# Altium project Smart Camera.PrjPcb (part 1 of 2)
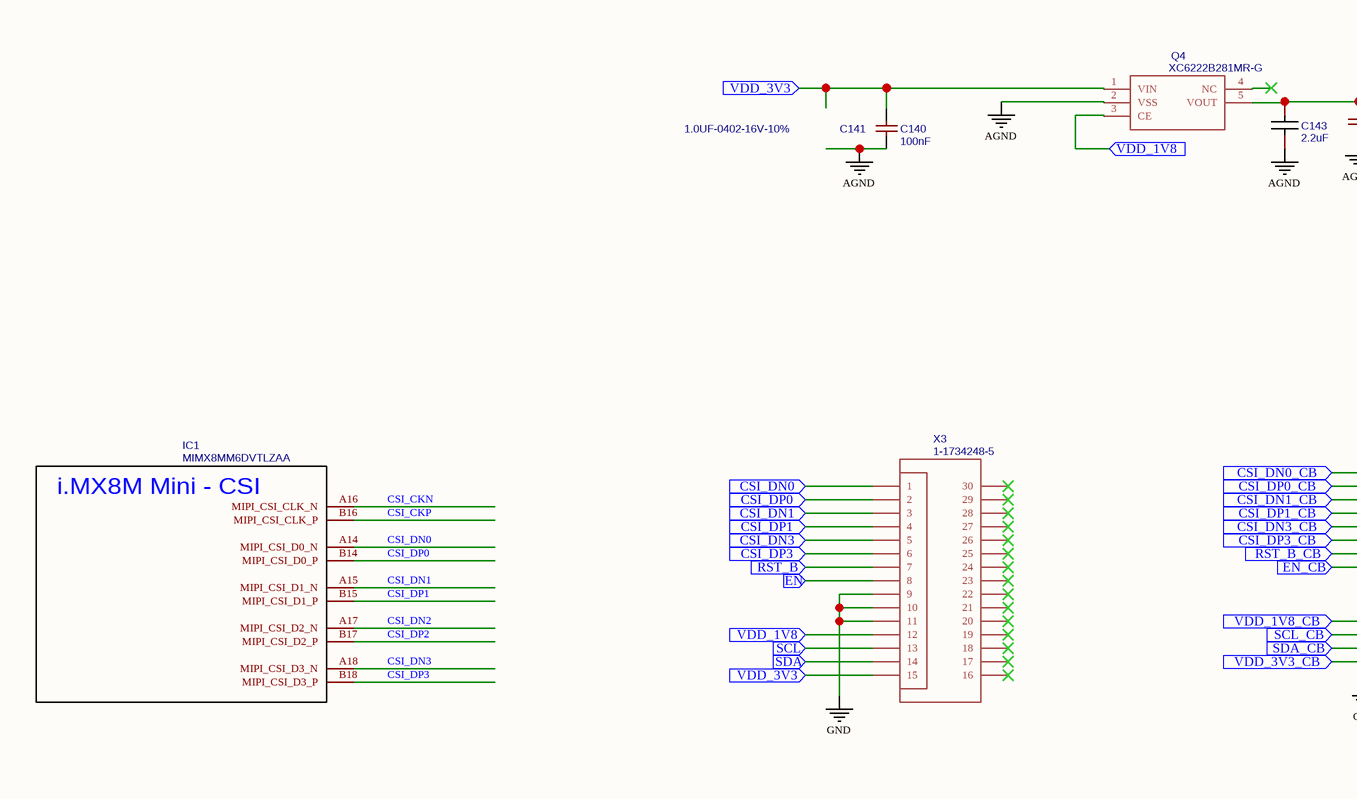
[diagram p0: CAMERA.schdoc, left]
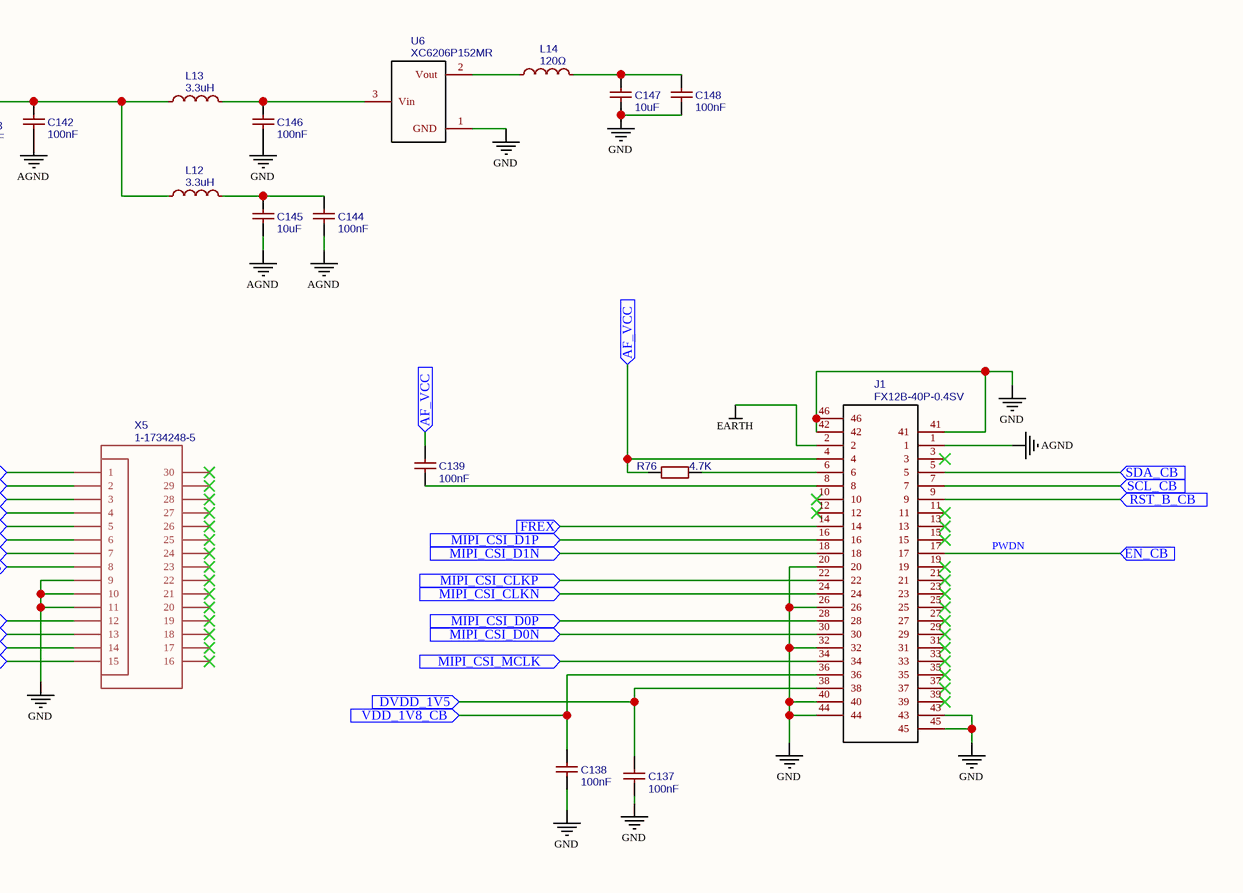
[diagram p1: CAMERA.schdoc, right]
12 sheets, 363 parts. Net scope: flat (ports and power ports of the same name join across sheets).
Sheets:
  CAMERA.schdoc
  CPU MISC.schdoc
  DDR4.schdoc
  JTAG.schdoc
  NAND.schdoc
  NOT CONNECTED.schdoc
  PMIC.schdoc
  PoE FLYBACK.schdoc
  PoE.schdoc
  POWER.schdoc
  SYS_POWER.schdoc
  BT.schdoc

## Sheet CAMERA.schdoc
size 489 x 171 mm

### Parts
(Parts that share a designator on the sheet are numbered #1, #2 ... from top to bottom, then left to right.)
C137  100nF  [C0402]
C138  100nF  [C0402]
C139  100nF  [C0402]
C140  100nF  [C0402]
C141  1.0UF-0402-16V-10%  [0402]
C142  100nF  [C0402]
C143  2.2uF  [C0402]
C144  100nF  [C0402]
C145  10uF  [C0805]
C146  100nF  [C0402]
C147  10uF  [C0805]
C148  100nF  [C0402]
IC1#1  MIMX8MM6DVTLZAA  [BGA486C50P27X27_1400X1400X125]
J1  FX12B-40P-0.4SV  [FX12B40P04SV]
L12  3.3uH  [L0402]
L13  3.3uH  [L0402]
L14  120Ω  [L0402]
Q4  XC6222B281MR-G  [SOT95P280X130-5N]
R76  4.7K  [R0402]
U6  XC6206P152MR  [SOT-23-3_L2.9-W1.6-P1.90-LS2.8-BR]
X3  1-1734248-5  [1-1734248-5]
X5  1-1734248-5  [1-1734248-5]

### Ports
AF_VCC (in), CSI_DN0 (in), CSI_DN0_CB (in), CSI_DN1 (in), CSI_DN1_CB (in), CSI_DN3 (in), CSI_DN3_CB (in), CSI_DP0 (in), CSI_DP0_CB (in), CSI_DP1 (in), CSI_DP1_CB (in), CSI_DP3 (in), CSI_DP3_CB (in), DVDD_1V5 (in), EN (in), EN_CB (in), FREX (in), MIPI_CSI_CLKN (in), MIPI_CSI_CLKP (in), MIPI_CSI_D0N (in), MIPI_CSI_D0P (in), MIPI_CSI_D1N (in), MIPI_CSI_D1P (in), MIPI_CSI_MCLK (in), RST_B (in), RST_B_CB (in), SCL (in), SCL_CB (in), SDA (in), SDA_CB (in), VDD_1V8 (in), VDD_1V8_CB (in), VDD_3V3 (in), VDD_3V3_CB (in)

### Nets
AGND: C140.1 C142.1 C143.1 C144.1 C145.1 J1.1 Q4.2(VSS)
EARTH: J1.2
GND: C137.1 C138.1 C146.1 C147.1 C148.1 J1.20 J1.26 J1.32 J1.40 J1.41 J1.42 J1.43 J1.44 J1.45 J1.46 U6.1(GND) X3.9 X3.10 X3.11 X5.9 X5.10 X5.11
CSI_CKN: IC1#1.A16(MIPI_CSI_CLK_N)
CSI_CKP: IC1#1.B16(MIPI_CSI_CLK_P)
CSI_DN0: IC1#1.A14(MIPI_CSI_D0_N)
CSI_DN1: IC1#1.A15(MIPI_CSI_D1_N)
CSI_DN2: IC1#1.A17(MIPI_CSI_D2_N)
CSI_DN3: IC1#1.A18(MIPI_CSI_D3_N)
CSI_DP0: IC1#1.B14(MIPI_CSI_D0_P)
CSI_DP1: IC1#1.B15(MIPI_CSI_D1_P)
CSI_DP2: IC1#1.B17(MIPI_CSI_D2_P)
CSI_DP3: IC1#1.B18(MIPI_CSI_D3_P)
PWDN: J1.17 X5.8 ; port EN_CB
NetC33_2: Q4.3(CE) X3.12 ; port VDD_1V8
NetC37_2: C140.2 Q4.1(VIN) X3.15 ; port VDD_3V3
NetC137_2: C137.2 J1.38 ; port DVDD_1V5
NetC138_2: C138.2 J1.36 X5.12 ; port VDD_1V8_CB
NetC139_1: C139.1 J1.8
NetC139_2: C139.2 J1.4 R76.1 ; port AF_VCC
NetC142_2: C142.2 C143.2 L12.1 L13.1 Q4.5(VOUT)
NetC144_2: C144.2 C145.2 L12.2
NetC146_2: C146.2 L13.2 U6.3(Vin)
NetC147_2: C147.2 C148.2 L14.2
NetJ1_5: J1.5 X5.14 ; port SDA_CB
NetJ1_6: J1.6 R76.2
NetJ1_7: J1.7 X5.13 ; port SCL_CB
NetJ1_9: J1.9 X5.7 ; port RST_B_CB
NetJ1_14: J1.14 ; port FREX
NetJ1_16: J1.16 ; port MIPI_CSI_D1P
NetJ1_18: J1.18 ; port MIPI_CSI_D1N
NetJ1_22: J1.22 ; port MIPI_CSI_CLKP
NetJ1_24: J1.24 ; port MIPI_CSI_CLKN
NetJ1_28: J1.28 ; port MIPI_CSI_D0P
NetJ1_30: J1.30 ; port MIPI_CSI_D0N
NetJ1_34: J1.34 ; port MIPI_CSI_MCLK
NetL14_1: L14.1 U6.2(Vout)
NetX3_1: X3.1 ; port CSI_DN0
NetX3_2: X3.2 ; port CSI_DP0
NetX3_3: X3.3 ; port CSI_DN1
NetX3_4: X3.4 ; port CSI_DP1
NetX3_5: X3.5 ; port CSI_DN3
NetX3_6: X3.6 ; port CSI_DP3
NetX3_7: X3.7 ; port RST_B
NetX3_8: X3.8 ; port EN
NetX3_13: X3.13 ; port SCL
NetX3_14: X3.14 ; port SDA
NetX5_1: X5.1 ; port CSI_DN0_CB
NetX5_2: X5.2 ; port CSI_DP0_CB
NetX5_3: X5.3 ; port CSI_DN1_CB
NetX5_4: X5.4 ; port CSI_DP1_CB
NetX5_5: X5.5 ; port CSI_DN3_CB
NetX5_6: X5.6 ; port CSI_DP3_CB
NetX5_15: X5.15 ; port VDD_3V3_CB

Not connected (* = marked no-connect by the designer): J1 3* 10* 11* 12* 13* 15* 19* 21* 23* 25* 27* 29* 31* 33* 35* 37* 39*; Q4 4(NC)*; X3 16* 17* 18* 19* 20* 21* 22* 23* 24* 25* 26* 27* 28* 29* 30*; X5 16* 17* 18* 19* 20* 21* 22* 23* 24* 25* 26* 27* 28* 29* 30*

### Notes on the sheet
- (in symbol MIMX8MM6DVTLZAA) i.MX8M Mini - CSI

### Library data of the parts
C137-C140 C142 C144 C146 C148 = 100nF: BOM_Manufacturer Part: CL05B104KO5NNNC; BOM_Manufacturer: SAMSUNG; nameAlias: Capacitance; SMT Type: Basic; BOM_Supplier: LCSC; BOM_Supplier Part: C1525; BOM_JLCPCB SMD: Yes; spicePre: C; spiceSymbolName: CL05B104KO5NNNC
C141 = 1.0UF-0402-16V-10%: Contributor: Victor De la Torre; spicePre: C; spiceSymbolName: 1.0UF-0402-16V-10%
C143 = 2.2uF: BOM_Manufacturer Part: CL05A225MQ5NSNC; BOM_Manufacturer: SAMSUNG; nameAlias: Capacitance; SMT Type: Extend; BOM_Supplier: LCSC; BOM_Supplier Part: C12530; BOM_JLCPCB SMD: Yes; spicePre: C; spiceSymbolName: CL05A225MQ5NSNC
C145 C147 = 10uF: BOM_Manufacturer Part: CL21A106KAYNNNE; BOM_Manufacturer: SAMSUNG; nameAlias: Capacitance; SMT Type: Basic; BOM_Supplier: LCSC; BOM_Supplier Part: C15850; BOM_JLCPCB SMD: Yes; spicePre: C; spiceSymbolName: CL21A106KAYNNNE
IC1#1 = MIMX8MM6DVTLZAA: subpart_no: 2; Contributor: Ke'Ondrae_Mell; spicePre: I; spiceSymbolName: MIMX8MM6DVTLZAA
J1 = FX12B-40P-0.4SV: Contributor: Ke'Ondrae_Mell; spicePre: J; spiceSymbolName: FX12B-40P-0.4SV
L12 L13 = 3.3uH: BOM_Manufacturer Part: SDFL1005Q3R3KTF; BOM_Manufacturer: Sunlord; nameAlias: Inductance; SMT Type: Extend; BOM_Supplier: LCSC; BOM_Supplier Part: C84474; BOM_JLCPCB SMD: Yes; spicePre: L; spiceSymbolName: SDFL1005Q3R3KTF
L14 = 120Ω: BOM_Manufacturer: MuRata; BOM_Manufacturer Part: BLM15AG121SN1D; nameAlias: Value; SMT Type: Extend; BOM_Supplier: LCSC; BOM_Supplier Part: C85812; BOM_JLCPCB SMD: Yes; spicePre: L; spiceSymbolName: BLM15AG121SN1D
Q4 = XC6222B281MR-G: Contributor: Ke'Ondrae_Mell; spicePre: Q; spiceSymbolName: XC6222B281MR-G
R76 = 4.7K: BOM_Manufacturer: UniOhm; BOM_Manufacturer Part: 0402WGF4701TCE; nameAlias: Resistance (Ohms); SMT Type: Basic; BOM_Supplier: LCSC; BOM_Supplier Part: C25900; BOM_JLCPCB SMD: Yes; spicePre: R; spiceSymbolName: 0402WGF4701TCE
U6 = XC6206P152MR: BOM_Manufacturer: TOREX; SMT Type: Extend; BOM_Supplier: LCSC; BOM_Manufacturer Part: XC6206P152MR; image: //image.lceda.cn/szlcsc/C56110.jpg; BOM_Supplier Part: C56110; BOM_JLCPCB SMD: Yes; spicePre: U; spiceSymbolName: XC6206P152MR
X3 X5 = 1-1734248-5: Contributor: IBE_Acc; spicePre: X; spiceSymbolName: 1-1734248-5

## Sheet CPU MISC.schdoc
size 451 x 234 mm
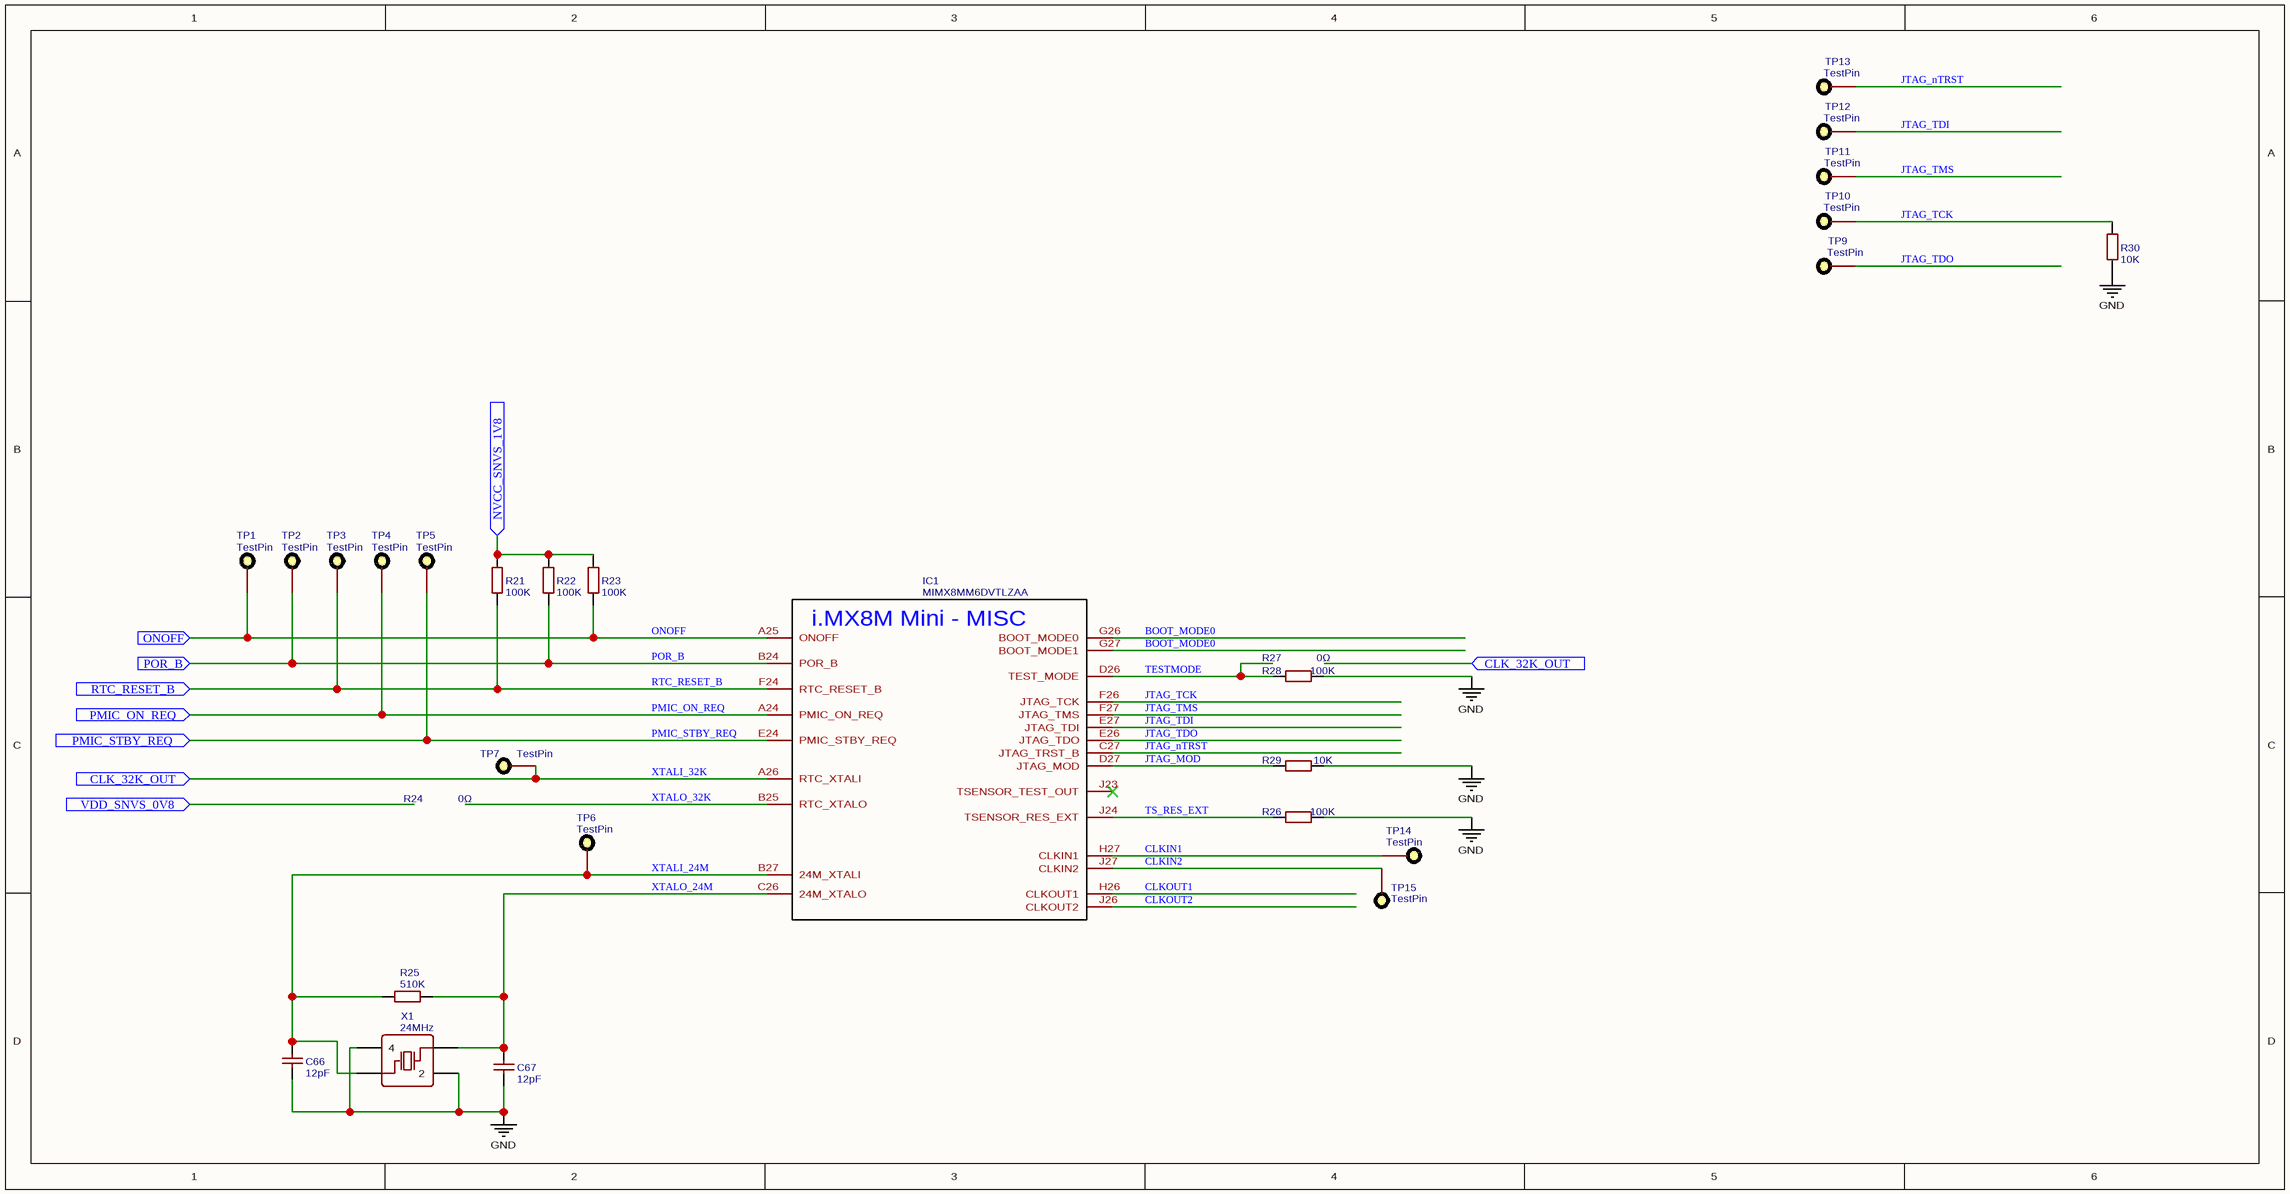
[diagram p2: CPU MISC.schdoc]

### Parts
(Parts that share a designator on the sheet are numbered #1, #2 ... from top to bottom, then left to right.)
C66  12pF  [C0402]
C67  12pF  [C0402]
IC1#2  MIMX8MM6DVTLZAA  [BGA486C50P27X27_1400X1400X125]
R21  100K  [R0402]
R22  100K  [R0402]
R23  100K  [R0402]
R24  0Ω  [1206]
R25  510K  [R0402]
R26  100K  [R0402]
R27  0Ω  [1206]
R28  100K  [R0402]
R29  10K  [R0402]
R30  10K  [R0402]
TP1  TestPin  [TESTPIN]
TP2  TestPin  [TESTPIN]
TP3  TestPin  [TESTPIN]
TP4  TestPin  [TESTPIN]
TP5  TestPin  [TESTPIN]
TP6  TestPin  [TESTPIN]
TP7  TestPin  [TESTPIN]
TP9  TestPin  [TESTPIN]
TP10  TestPin  [TESTPIN]
TP11  TestPin  [TESTPIN]
TP12  TestPin  [TESTPIN]
TP13  TestPin  [TESTPIN]
TP14  TestPin  [TESTPIN]
TP15  TestPin  [TESTPIN]
X1  24MHz  [OSC-SMD_4P-L3.2-W2.5-BL]

### Ports
CLK_32K_OUT (in), NVCC_SNVS_1V8 (in), ONOFF (in), PMIC_ON_REQ (in), PMIC_STBY_REQ (in), POR_B (in), RTC_RESET_B (in), VDD_SNVS_0V8 (in)

### Nets
GND: C66.1 C67.1 R26.1 R28.1 R29.2 R30.1 X1.2 X1.4
BOOT_MODE0: IC1#2.G26(BOOT_MODE0) IC1#2.G27(BOOT_MODE1)
CLKIN1: IC1#2.H27(CLKIN1) TP14.1
CLKIN2: IC1#2.J27(CLKIN2) TP15.1
CLKOUT1: IC1#2.H26(CLKOUT1)
CLKOUT2: IC1#2.J26(CLKOUT2)
JTAG_MOD: IC1#2.D27(JTAG_MOD) R29.1
JTAG_nTRST: IC1#2.C27(JTAG_TRST_B) TP13.1
JTAG_TCK: IC1#2.F26(JTAG_TCK) R30.2 TP10.1
JTAG_TDI: IC1#2.E27(JTAG_TDI) TP12.1
JTAG_TDO: IC1#2.E26(JTAG_TDO) TP9.1
JTAG_TMS: IC1#2.F27(JTAG_TMS) TP11.1
ONOFF: IC1#2.A25(ONOFF) R23.1 TP1.1 ; port ONOFF
PMIC_ON_REQ: IC1#2.A24(PMIC_ON_REQ) TP4.1 ; port PMIC_ON_REQ
PMIC_STBY_REQ: IC1#2.E24(PMIC_STBY_REQ) TP5.1 ; port PMIC_STBY_REQ
POR_B: IC1#2.B24(POR_B) R22.1 TP2.1 ; port POR_B
RTC_RESET_B: IC1#2.F24(RTC_RESET_B) R21.1 TP3.1 ; port RTC_RESET_B
TESTMODE: IC1#2.D26(TEST_MODE) R28.2
TS_RES_EXT: IC1#2.J24(TSENSOR_RES_EXT) R26.2
XTALI_24M: C66.2 IC1#2.B27(24M_XTALI) R25.1 TP6.1 X1.1(OSC1)
XTALI_32K: IC1#2.A26(RTC_XTALI) TP7.1 ; port CLK_32K_OUT
XTALO_24M: C67.2 IC1#2.C26(24M_XTALO) R25.2 X1.3(OSC2)
XTALO_32K: IC1#2.B25(RTC_XTALO)
NetC1_2: R21.2 R22.2 R23.2 ; port NVCC_SNVS_1V8

Not connected (* = marked no-connect by the designer): IC1#2 J23(TSENSOR_TEST_OUT)*

### Notes on the sheet
- (in symbol MIMX8MM6DVTLZAA) i.MX8M Mini - MISC

### Library data of the parts
C66 C67 = 12pF: BOM_Manufacturer: FH; BOM_Manufacturer Part: 0402CG120J500NT; nameAlias: Capacitance; SMT Type: Basic; BOM_Supplier: LCSC; BOM_Supplier Part: C1547; BOM_JLCPCB SMD: Yes; spicePre: C; spiceSymbolName: 0402CG120J500NT
IC1#2 = MIMX8MM6DVTLZAA: as IC1#1 on sheet CAMERA; spicePre: I; spiceSymbolName: MIMX8MM6DVTLZAA
R21-R23 R26 R28 = 100K: BOM_Manufacturer: UniOhm; BOM_Manufacturer Part: 0402WGF1003TCE; nameAlias: Resistance (Ohms); SMT Type: Basic; BOM_Supplier: LCSC; BOM_Supplier Part: C25741; BOM_JLCPCB SMD: Yes; spicePre: R; spiceSymbolName: 0402WGF1003TCE
R24 R27 = 0Ω: BOM_Manufacturer Part: 0R(000) ±1%; Value: 0Ω; BOM_Supplier Part: undefined; BOM_Supplier: LCSC; spicePre: R; spiceSymbolName: 0Ω
R25 = 510K: BOM_Manufacturer: UniOhm; BOM_Manufacturer Part: 0402WGF5103TCE; nameAlias: Resistance (Ohms); SMT Type: Basic; BOM_Supplier: LCSC; BOM_Supplier Part: C11616; BOM_JLCPCB SMD: Yes; spicePre: R; spiceSymbolName: 0402WGF5103TCE
R29 R30 = 10K: BOM_Manufacturer: UniOhm; BOM_Manufacturer Part: TC0225F1002TCE; nameAlias: Resistance (Ohms); SMT Type: Extend; BOM_Supplier: LCSC; BOM_Supplier Part: C98838; BOM_JLCPCB SMD: Yes; spicePre: R; spiceSymbolName: TC0225F1002TCE
TP1-TP7 TP9-TP15 = TestPin: Contributor: alan.green; sourceId: WTb5nFXR9; timeStamp: 1460711565; spicePre: T; spiceSymbolName: TestPin
X1 = 24MHz: BOM_Manufacturer: KDS; BOM_Manufacturer Part: DSX321G 24MHz; nameAlias: Frequency; Contributor: LCSC; SMT Type: Extend; BOM_Supplier: LCSC; BOM_Supplier Part: C93235; BOM_JLCPCB SMD: Yes; spicePre: X; spiceSymbolName: DSX321G 24MHz

## Sheet DDR4.schdoc
size 492 x 319 mm
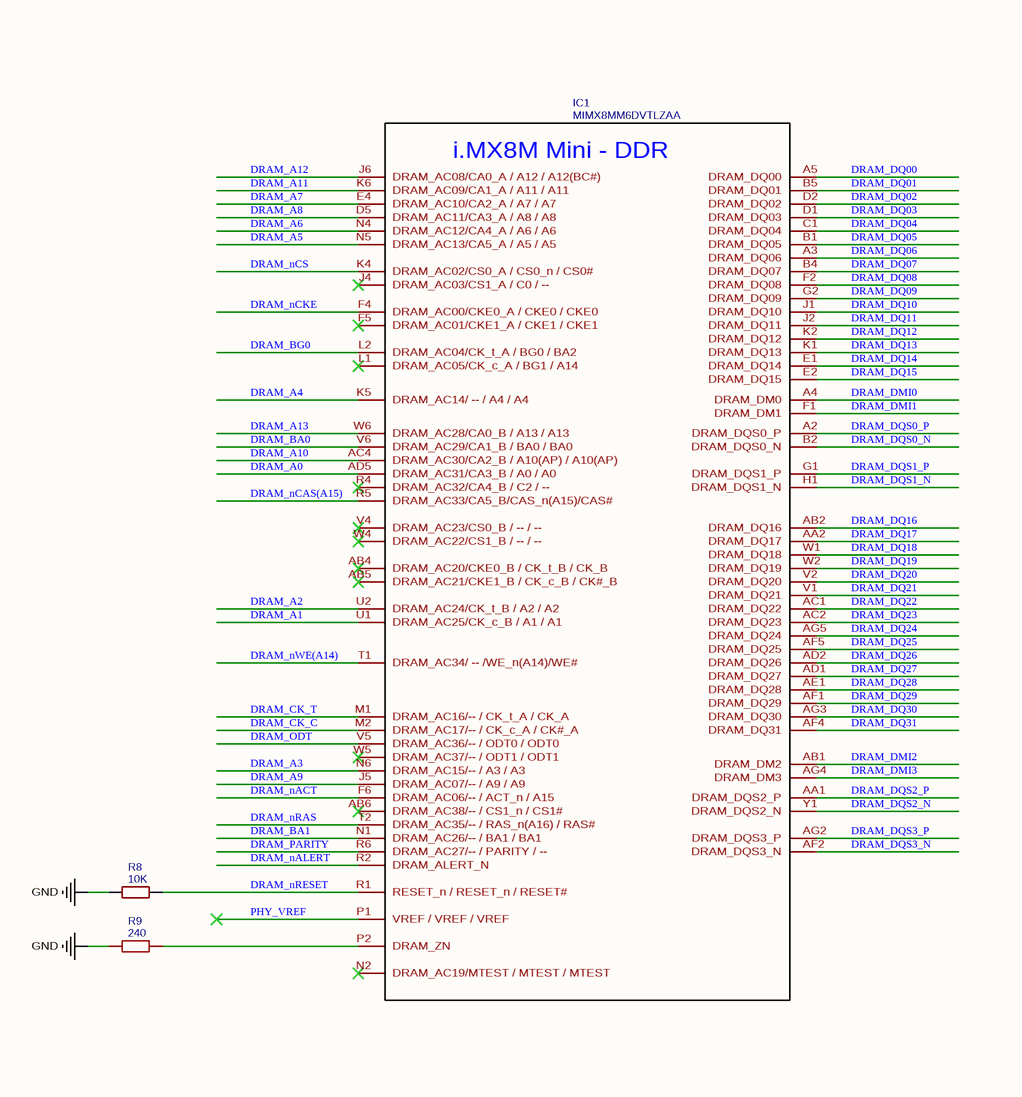
[diagram p3: DDR4.schdoc, left]
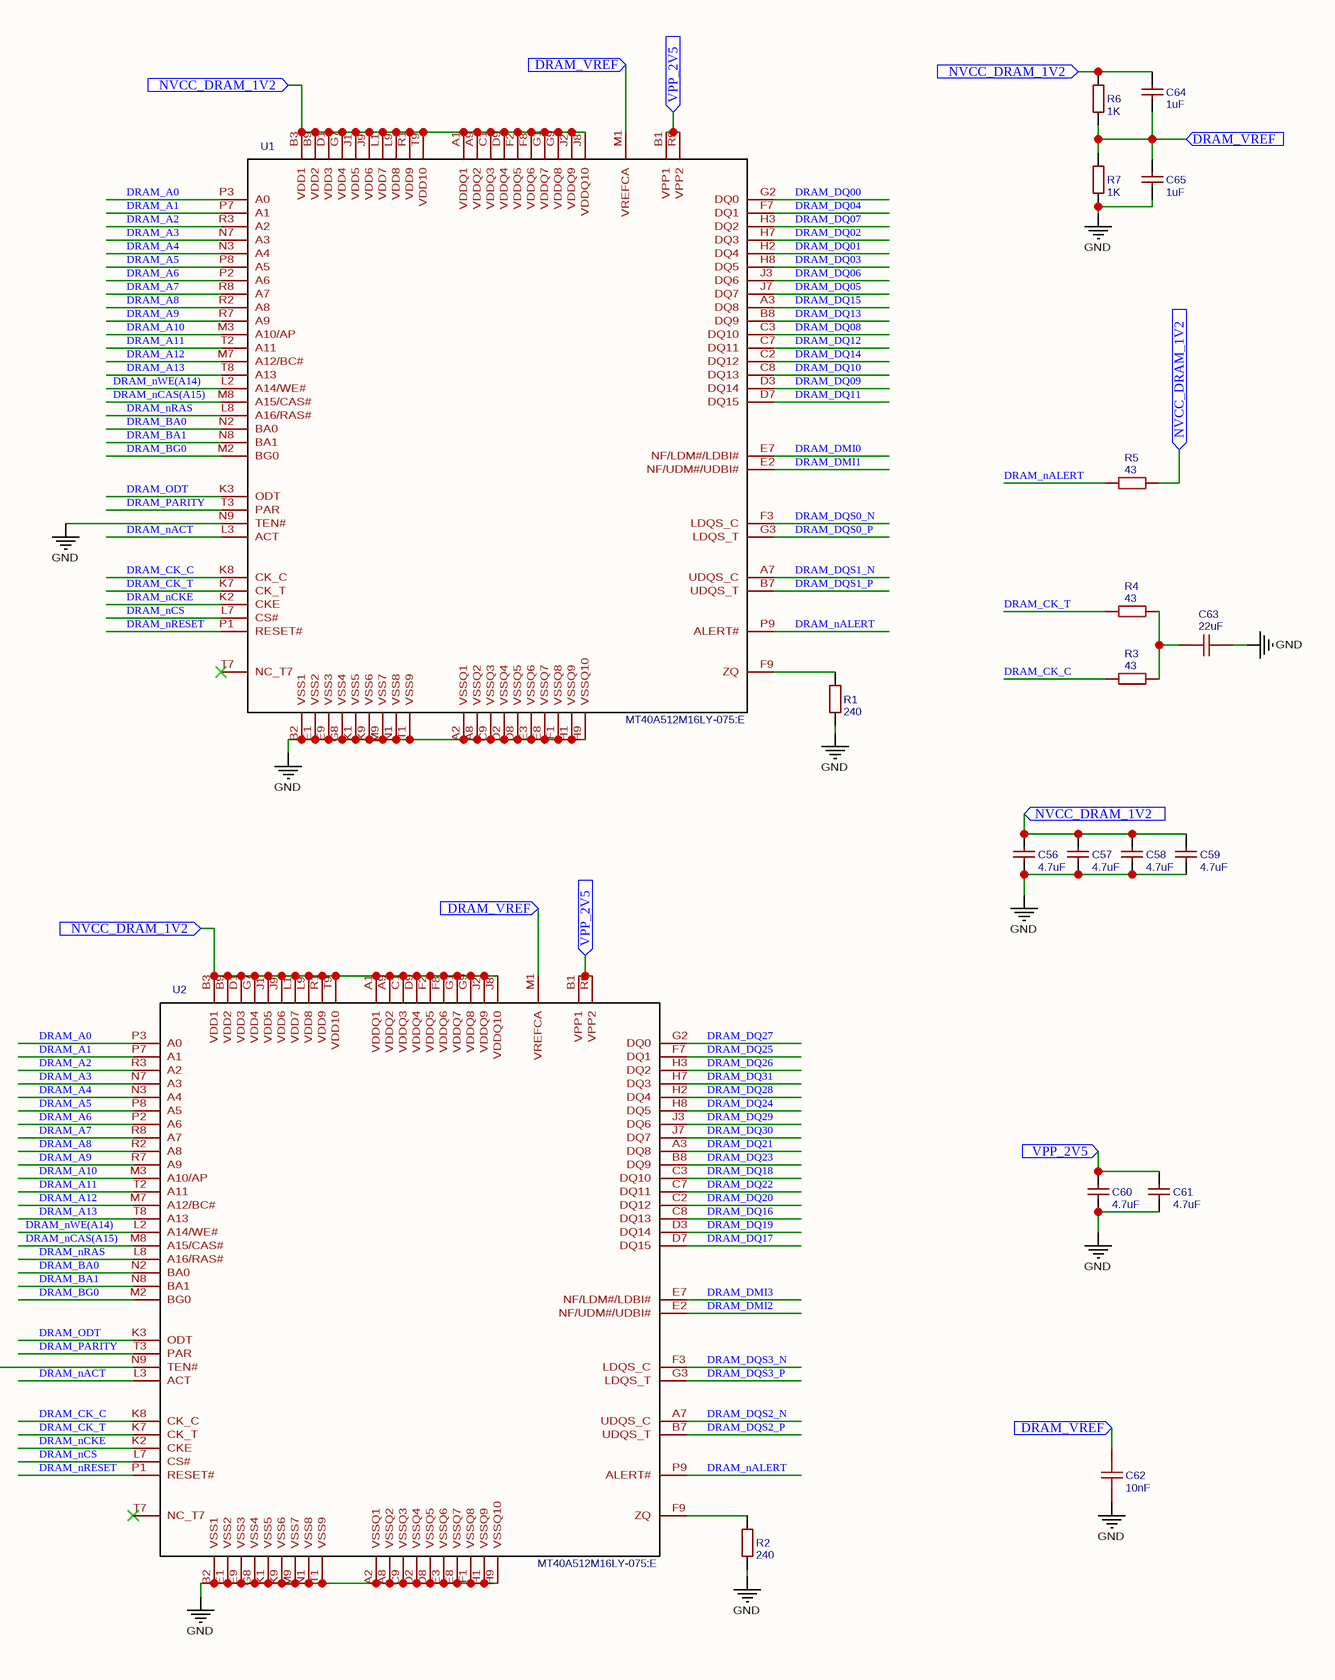
[diagram p4: DDR4.schdoc, right]

### Parts
(Parts that share a designator on the sheet are numbered #1, #2 ... from top to bottom, then left to right.)
C56  4.7uF  [C0402]
C57  4.7uF  [C0402]
C58  4.7uF  [C0402]
C59  4.7uF  [C0402]
C60  4.7uF  [C0402]
C61  4.7uF  [C0402]
C62  10nF  [C0603]
C63  22uF  [C0603]
C64  1uF  [C0402]
C65  1uF  [C0402]
IC1#3  MIMX8MM6DVTLZAA  [BGA486C50P27X27_1400X1400X125]
R1  240  [R0603]
R2  240  [R0603]
R3  43  [R0402]
R4  43  [R0402]
R5  43  [R0402]
R6  1K  [R0402]
R7  1K  [R0402]
R8  10K  [R0603]
R9  240  [R0402]
U1  MT40A512M16LY-075:E  [FBGA-96_L13.5-W7.5-R16-C6-P0.80-TL]
U2  MT40A512M16LY-075:E  [FBGA-96_L13.5-W7.5-R16-C6-P0.80-TL]

### Ports
DRAM_VREF (in), NVCC_DRAM_1V2 (in), VPP_2V5 (in)

### Nets
GND: C56.1 C57.1 C58.1 C59.1 C60.1 C61.1 C62.1 C63.2 C65.1 R1.1 R2.1 R7.1 R8.1 R9.1 U1.A2(VSSQ1) U1.A8(VSSQ2) U1.B2(VSS1) U1.C9(VSSQ3) U1.D2(VSSQ4) U1.D8(VSSQ5) U1.E1(VSS2) U1.E3(VSSQ6) U1.E8(VSSQ7) U1.E9(VSS3) U1.F1(VSSQ8) U1.G8(VSS4) U1.H1(VSSQ9) U1.H9(VSSQ10) U1.K1(VSS5) U1.K9(VSS6) U1.M9(VSS7) U1.N1(VSS8) U1.N9(TEN#) U1.T1(VSS9) U2.A2(VSSQ1) U2.A8(VSSQ2) U2.B2(VSS1) U2.C9(VSSQ3) U2.D2(VSSQ4) U2.D8(VSSQ5) U2.E1(VSS2) U2.E3(VSSQ6) U2.E8(VSSQ7) U2.E9(VSS3) U2.F1(VSSQ8) U2.G8(VSS4) U2.H1(VSSQ9) U2.H9(VSSQ10) U2.K1(VSS5) U2.K9(VSS6) U2.M9(VSS7) U2.N1(VSS8) U2.T1(VSS9)
DRAM_A0: IC1#3.AD5(DRAM_AC31/CA3_B_/_A0_/_A0) U1.P3(A0) U2.P3(A0)
DRAM_A1: IC1#3.U1(DRAM_AC25/CK_c_B_/_A1_/_A1) U1.P7(A1) U2.P7(A1)
DRAM_A2: IC1#3.U2(DRAM_AC24/CK_t_B_/_A2_/_A2) U1.R3(A2) U2.R3(A2)
DRAM_A3: IC1#3.N6(DRAM_AC15/--_/_A3_/_A3) U1.N7(A3) U2.N7(A3)
DRAM_A4: IC1#3.K5(DRAM_AC14/_--_/_A4_/_A4) U1.N3(A4) U2.N3(A4)
DRAM_A5: IC1#3.N5(DRAM_AC13/CA5_A_/_A5_/_A5) U1.P8(A5) U2.P8(A5)
DRAM_A6: IC1#3.N4(DRAM_AC12/CA4_A_/_A6_/_A6) U1.P2(A6) U2.P2(A6)
DRAM_A7: IC1#3.E4(DRAM_AC10/CA2_A_/_A7_/_A7) U1.R8(A7) U2.R8(A7)
DRAM_A8: IC1#3.D5(DRAM_AC11/CA3_A_/_A8_/_A8) U1.R2(A8) U2.R2(A8)
DRAM_A9: IC1#3.J5(DRAM_AC07/--_/_A9_/_A9) U1.R7(A9) U2.R7(A9)
DRAM_A10: IC1#3.AC4(DRAM_AC30/CA2_B_/_A10(AP)_/_A10(AP)) U1.M3(A10/AP) U2.M3(A10/AP)
DRAM_A11: IC1#3.K6(DRAM_AC09/CA1_A_/_A11_/_A11) U1.T2(A11) U2.T2(A11)
DRAM_A12: IC1#3.J6(DRAM_AC08/CA0_A_/_A12_/_A12(BC#)) U1.M7(A12/BC#) U2.M7(A12/BC#)
DRAM_A13: IC1#3.W6(DRAM_AC28/CA0_B_/_A13_/_A13) U1.T8(A13) U2.T8(A13)
DRAM_BA0: IC1#3.V6(DRAM_AC29/CA1_B_/_BA0_/_BA0) U1.N2(BA0) U2.N2(BA0)
DRAM_BA1: IC1#3.N1(DRAM_AC26/--_/_BA1_/_BA1) U1.N8(BA1) U2.N8(BA1)
DRAM_BG0: IC1#3.L2(DRAM_AC04/CK_t_A_/_BG0_/_BA2) U1.M2(BG0) U2.M2(BG0)
DRAM_CK_C: IC1#3.M2(DRAM_AC17/--_/_CK_c_A_/_CK#_A) R3.1 U1.K8(CK_C) U2.K8(CK_C)
DRAM_CK_T: IC1#3.M1(DRAM_AC16/--_/_CK_t_A_/_CK_A) R4.1 U1.K7(CK_T) U2.K7(CK_T)
DRAM_DMI0: IC1#3.A4(DRAM_DM0) U1.E7(NF/LDM#/LDBI#)
DRAM_DMI1: IC1#3.F1(DRAM_DM1) U1.E2(NF/UDM#/UDBI#)
DRAM_DMI2: IC1#3.AB1(DRAM_DM2) U2.E2(NF/UDM#/UDBI#)
DRAM_DMI3: IC1#3.AG4(DRAM_DM3) U2.E7(NF/LDM#/LDBI#)
DRAM_DQ00: IC1#3.A5(DRAM_DQ00) U1.G2(DQ0)
DRAM_DQ01: IC1#3.B5(DRAM_DQ01) U1.H2(DQ4)
DRAM_DQ02: IC1#3.D2(DRAM_DQ02) U1.H7(DQ3)
DRAM_DQ03: IC1#3.D1(DRAM_DQ03) U1.H8(DQ5)
DRAM_DQ04: IC1#3.C1(DRAM_DQ04) U1.F7(DQ1)
DRAM_DQ05: IC1#3.B1(DRAM_DQ05) U1.J7(DQ7)
DRAM_DQ06: IC1#3.A3(DRAM_DQ06) U1.J3(DQ6)
DRAM_DQ07: IC1#3.B4(DRAM_DQ07) U1.H3(DQ2)
DRAM_DQ08: IC1#3.F2(DRAM_DQ08) U1.C3(DQ10)
DRAM_DQ09: IC1#3.G2(DRAM_DQ09) U1.D3(DQ14)
DRAM_DQ10: IC1#3.J1(DRAM_DQ10) U1.C8(DQ13)
DRAM_DQ11: IC1#3.J2(DRAM_DQ11) U1.D7(DQ15)
DRAM_DQ12: IC1#3.K2(DRAM_DQ12) U1.C7(DQ11)
DRAM_DQ13: IC1#3.K1(DRAM_DQ13) U1.B8(DQ9)
DRAM_DQ14: IC1#3.E1(DRAM_DQ14) U1.C2(DQ12)
DRAM_DQ15: IC1#3.E2(DRAM_DQ15) U1.A3(DQ8)
DRAM_DQ16: IC1#3.AB2(DRAM_DQ16) U2.C8(DQ13)
DRAM_DQ17: IC1#3.AA2(DRAM_DQ17) U2.D7(DQ15)
DRAM_DQ18: IC1#3.W1(DRAM_DQ18) U2.C3(DQ10)
DRAM_DQ19: IC1#3.W2(DRAM_DQ19) U2.D3(DQ14)
DRAM_DQ20: IC1#3.V2(DRAM_DQ20) U2.C2(DQ12)
DRAM_DQ21: IC1#3.V1(DRAM_DQ21) U2.A3(DQ8)
DRAM_DQ22: IC1#3.AC1(DRAM_DQ22) U2.C7(DQ11)
DRAM_DQ23: IC1#3.AC2(DRAM_DQ23) U2.B8(DQ9)
DRAM_DQ24: IC1#3.AG5(DRAM_DQ24) U2.H8(DQ5)
DRAM_DQ25: IC1#3.AF5(DRAM_DQ25) U2.F7(DQ1)
DRAM_DQ26: IC1#3.AD2(DRAM_DQ26) U2.H3(DQ2)
DRAM_DQ27: IC1#3.AD1(DRAM_DQ27) U2.G2(DQ0)
DRAM_DQ28: IC1#3.AE1(DRAM_DQ28) U2.H2(DQ4)
DRAM_DQ29: IC1#3.AF1(DRAM_DQ29) U2.J3(DQ6)
DRAM_DQ30: IC1#3.AG3(DRAM_DQ30) U2.J7(DQ7)
DRAM_DQ31: IC1#3.AF4(DRAM_DQ31) U2.H7(DQ3)
DRAM_DQS0_N: IC1#3.B2(DRAM_DQS0_N) U1.F3(LDQS_C)
DRAM_DQS0_P: IC1#3.A2(DRAM_DQS0_P) U1.G3(LDQS_T)
DRAM_DQS1_N: IC1#3.H1(DRAM_DQS1_N) U1.A7(UDQS_C)
DRAM_DQS1_P: IC1#3.G1(DRAM_DQS1_P) U1.B7(UDQS_T)
DRAM_DQS2_N: IC1#3.Y1(DRAM_DQS2_N) U2.A7(UDQS_C)
DRAM_DQS2_P: IC1#3.AA1(DRAM_DQS2_P) U2.B7(UDQS_T)
DRAM_DQS3_N: IC1#3.AF2(DRAM_DQS3_N) U2.F3(LDQS_C)
DRAM_DQS3_P: IC1#3.AG2(DRAM_DQS3_P) U2.G3(LDQS_T)
DRAM_nACT: IC1#3.F6(DRAM_AC06/--_/_ACT_n_/_A15) U1.L3(ACT) U2.L3(ACT)
DRAM_nALERT: IC1#3.R2(DRAM_ALERT_N) R5.1 U1.P9(ALERT#) U2.P9(ALERT#)
DRAM_nCAS(A15): IC1#3.R5(DRAM_AC33/CA5_B/CAS_n(A15)/CAS#) U1.M8(A15/CAS#) U2.M8(A15/CAS#)
DRAM_nCKE: IC1#3.F4(DRAM_AC00/CKE0_A_/_CKE0_/_CKE0) U1.K2(CKE) U2.K2(CKE)
DRAM_nCS: IC1#3.K4(DRAM_AC02/CS0_A_/_CS0_n_/_CS0#) U1.L7(CS#) U2.L7(CS#)
DRAM_nRAS: IC1#3.T2(DRAM_AC35/--_/_RAS_n(A16)_/_RAS#) U1.L8(A16/RAS#) U2.L8(A16/RAS#)
DRAM_nRESET: IC1#3.R1(RESET_n_/_RESET_n_/_RESET#) R8.2 U1.P1(RESET#) U2.P1(RESET#)
DRAM_nWE(A14): IC1#3.T1(DRAM_AC34/_--_/WE_n(A14)/WE#) U1.L2(A14/WE#) U2.L2(A14/WE#)
DRAM_ODT: IC1#3.V5(DRAM_AC36/--_/_ODT0_/_ODT0) U1.K3(ODT) U2.K3(ODT)
DRAM_PARITY: IC1#3.R6(DRAM_AC27/--_/_PARITY_/_--) U1.T3(PAR) U2.T3(PAR)
PHY_VREF: IC1#3.P1(VREF_/_VREF_/_VREF)
NetC24_2: C56.2 C57.2 C58.2 C59.2 C64.2 R5.2 R6.2 U1.A1(VDDQ1) U1.A9(VDDQ2) U1.B3(VDD1) U1.B9(VDD2) U1.C1(VDDQ3) U1.D1(VDD3) U1.D9(VDDQ4) U1.F2(VDDQ5) U1.F8(VDDQ6) U1.G1(VDDQ7) U1.G7(VDD4) U1.G9(VDDQ8) U1.J1(VDD5) U1.J2(VDDQ9) U1.J8(VDDQ10) U1.J9(VDD6) U1.L1(VDD7) U1.L9(VDD8) U1.R1(VDD9) U1.T9(VDD10) U2.A1(VDDQ1) U2.A9(VDDQ2) U2.B3(VDD1) U2.B9(VDD2) U2.C1(VDDQ3) U2.D1(VDD3) U2.D9(VDDQ4) U2.F2(VDDQ5) U2.F8(VDDQ6) U2.G1(VDDQ7) U2.G7(VDD4) U2.G9(VDDQ8) U2.J1(VDD5) U2.J2(VDDQ9) U2.J8(VDDQ10) U2.J9(VDD6) U2.L1(VDD7) U2.L9(VDD8) U2.R1(VDD9) U2.T9(VDD10) ; port NVCC_DRAM_1V2
NetC60_2: C60.2 C61.2 U1.B1(VPP1) U1.R9(VPP2) U2.B1(VPP1) U2.R9(VPP2) ; port VPP_2V5
NetC62_2: C62.2 C64.1 C65.2 R6.1 R7.2 U1.M1(VREFCA) U2.M1(VREFCA) ; port DRAM_VREF
NetC63_1: C63.1 R3.2 R4.2
NetIC1#3_P2: IC1#3.P2(DRAM_ZN) R9.2
NetR1_2: R1.2 U1.F9(ZQ)
NetR2_2: R2.2 U2.F9(ZQ)

Not connected (* = marked no-connect by the designer): IC1#3 AB4(DRAM_AC20/CKE0_B_/_CK_t_B_/_CK_B)* AB5(DRAM_AC21/CKE1_B_/_CK_c_B_/_CK#_B)* AB6(DRAM_AC38/--_/_CS1_n_/_CS1#)* F5(DRAM_AC01/CKE1_A_/_CKE1_/_CKE1)* J4(DRAM_AC03/CS1_A_/_C0_/_--)* L1(DRAM_AC05/CK_c_A_/_BG1_/_A14)* N2(DRAM_AC19/MTEST_/_MTEST_/_MTEST)* R4(DRAM_AC32/CA4_B_/_C2_/_--)* V4(DRAM_AC23/CS0_B_/_--_/_--)* W4(DRAM_AC22/CS1_B_/_--_/_--)* W5(DRAM_AC37/--_/_ODT1_/_ODT1)*; U1 T7(NC_T7)*; U2 N9(TEN#) T7(NC_T7)*

### Notes on the sheet
- (in symbol MIMX8MM6DVTLZAA) i.MX8M Mini - DDR

### Library data of the parts
C56-C61 = 4.7uF: BOM_Manufacturer Part: CL05A475MP5NRNC; BOM_Manufacturer: SAMSUNG; nameAlias: Capacitance; SMT Type: Basic; BOM_Supplier: LCSC; BOM_Supplier Part: C23733; BOM_JLCPCB SMD: Yes; spicePre: C; spiceSymbolName: CL05A475MP5NRNC
C62 = 10nF: BOM_Manufacturer: SAMSUNG; BOM_Manufacturer Part: CL10B103JB8NNNC; nameAlias: Capacitance; SMT Type: Extend; BOM_Supplier: LCSC; BOM_Supplier Part: C7248; BOM_JLCPCB SMD: Yes; spicePre: C; spiceSymbolName: CL10B103JB8NNNC
C63 = 22uF: BOM_Manufacturer: SAMSUNG; BOM_Manufacturer Part: CL10A226MQ8NRNC; nameAlias: Capacitance; SMT Type: Basic; BOM_Supplier: LCSC; BOM_Supplier Part: C59461; BOM_JLCPCB SMD: Yes; spicePre: C; spiceSymbolName: CL10A226MQ8NRNC
C64 C65 = 1uF: BOM_Manufacturer Part: CL05A105KP5NNNC; BOM_Manufacturer: SAMSUNG; nameAlias: Capacitance; SMT Type: Extend; BOM_Supplier: LCSC; BOM_Supplier Part: C14445; BOM_JLCPCB SMD: Yes; spicePre: C; spiceSymbolName: CL05A105KP5NNNC
IC1#3 = MIMX8MM6DVTLZAA: as IC1#1 on sheet CAMERA; spicePre: I; spiceSymbolName: MIMX8MM6DVTLZAA
R1 R2 = 240: BOM_Manufacturer: UniOhm; BOM_Manufacturer Part: 0603WAF2400T5E; nameAlias: Resistance (Ohms); SMT Type: Basic; BOM_Supplier: LCSC; BOM_Supplier Part: C23350; BOM_JLCPCB SMD: Yes; spicePre: R; spiceSymbolName: 0603WAF2400T5E
R3-R5 = 43: BOM_Manufacturer: Uniroyal Elec; BOM_Manufacturer Part: 0402WGF430JTCE; nameAlias: Resistance (Ohms); Contributor: LCSC; SMT Type: Extend; BOM_Supplier: LCSC; BOM_Supplier Part: C270600; BOM_JLCPCB SMD: Yes; spicePre: R; spiceSymbolName: 0402WGF430JTCE
R6 R7 = 1K: BOM_Manufacturer: UniOhm; BOM_Manufacturer Part: 0402WGF1001TCE; nameAlias: Resistance (Ohms); SMT Type: Basic; BOM_Supplier: LCSC; BOM_Supplier Part: C11702; BOM_JLCPCB SMD: Yes; spicePre: R; spiceSymbolName: 0402WGF1001TCE
R8 = 10K: BOM_Manufacturer: UniOhm; BOM_Manufacturer Part: LE03WAJ0103T5E; nameAlias: Resistance (Ohms); SMT Type: Extend; BOM_Supplier: LCSC; BOM_Supplier Part: C81087; BOM_JLCPCB SMD: Yes; spicePre: R; spiceSymbolName: LE03WAJ0103T5E
R9 = 240: BOM_Manufacturer: Uniroyal Elec; BOM_Manufacturer Part: NQ02WGF2400TCE; nameAlias: Resistance (Ohms); Contributor: LCSC; SMT Type: Extend; BOM_Supplier: LCSC; BOM_Supplier Part: C270375; BOM_JLCPCB SMD: Yes; spicePre: R; spiceSymbolName: NQ02WGF2400TCE
U1 U2 = MT40A512M16LY-075:E: BOM_Manufacturer: Micron Tech; Contributor: Ke'Ondrae_Mell; BOM_Supplier: LCSC; BOM_Supplier Part: C598779; BOM_Manufacturer Part: MT40A512M16LY-075:E; spicePre: U; spiceSymbolName: MT40A512M16LY-075:E

## Sheet JTAG.schdoc
size 163 x 86 mm
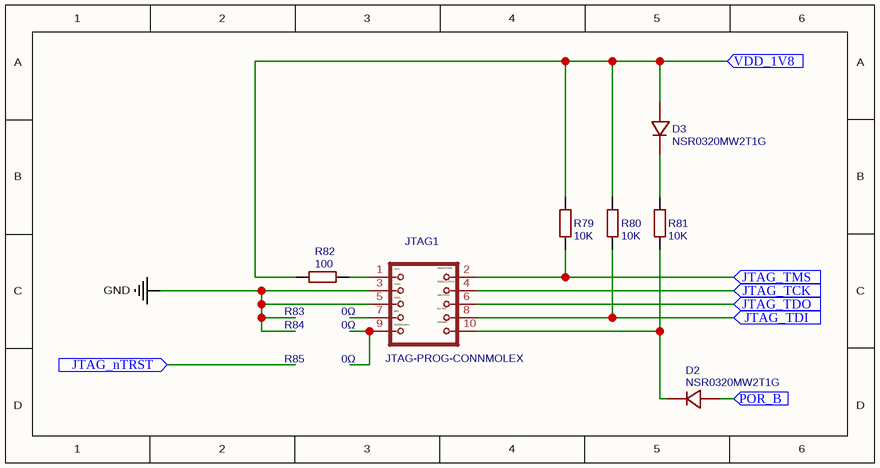
[diagram p5: JTAG.schdoc]

### Parts
D2  NSR0320MW2T1G  [SOD-323_L1.8-W1.3-LS2.5-RD]
D3  NSR0320MW2T1G  [SOD-323_L1.8-W1.3-LS2.5-RD]
JTAG1  JTAG-PROG-CONNMOLEX  [JTAG-10PIN-2.54MM-PTH]
R79  10K  [R0402]
R80  10K  [R0402]
R81  10K  [R0402]
R82  100  [R0402]
R83  0Ω  [1206]
R84  0Ω  [1206]
R85  0Ω  [1206]

### Ports
JTAG_nTRST (in), JTAG_TCK (in), JTAG_TDI (in), JTAG_TDO (in), JTAG_TMS (in), POR_B (in), VDD_1V8 (in)

### Nets
GND: JTAG1.3 JTAG1.5
POR_B: D2.2(A) ; port POR_B
NetC33_2: D3.2(A) R79.2 R80.2 R82.1 ; port VDD_1V8
NetD2_1: D2.1(C) JTAG1.10 R81.1
NetD3_1: D3.1(C) R81.2
NetJTAG1_1: JTAG1.1 R82.2
NetJTAG1_2: JTAG1.2 R79.1 ; port JTAG_TMS
NetJTAG1_4: JTAG1.4 ; port JTAG_TCK
NetJTAG1_6: JTAG1.6 ; port JTAG_TDO
NetJTAG1_8: JTAG1.8 R80.1 ; port JTAG_TDI

Not connected (* = marked no-connect by the designer): JTAG1 7 9

### Notes on the sheet
- (in symbol JTAG-PROG-CONNMOLEX) VCC; SWDIOTMS; GND; SWDCLKTCK; SWOTDO; KEY; NCTDI; GNDDetect; nRESET

### Library data of the parts
D2 D3 = NSR0320MW2T1G: BOM_Manufacturer: ON; SMT Type: Extend; BOM_Supplier: LCSC; BOM_Manufacturer Part: NSR0320MW2T1G; image: //image.lceda.cn/szlcsc/C48192.jpg; BOM_Supplier Part: C48192; BOM_JLCPCB SMD: Yes; spicePre: D; spiceSymbolName: NSR0320MW2T1G
JTAG1 = JTAG-PROG-CONNMOLEX: description: JTAG Program Connector; Contributor: PatternAgents; spicePre: J; spiceSymbolName: JTAG-PROG-CONNMOLEX
R79-R81 = 10K: BOM_Manufacturer: UniOhm; BOM_Manufacturer Part: 0402WGF1002TCE; nameAlias: Resistance (Ohms); SMT Type: Basic; BOM_Supplier: LCSC; BOM_Supplier Part: C25744; BOM_JLCPCB SMD: Yes; spicePre: R; spiceSymbolName: 0402WGF1002TCE
R82 = 100: BOM_Manufacturer: UniOhm; BOM_Manufacturer Part: 0402WGF1000TCE; nameAlias: Resistance (Ohms); SMT Type: Basic; BOM_Supplier: LCSC; BOM_Supplier Part: C25076; BOM_JLCPCB SMD: Yes; spicePre: R; spiceSymbolName: 0402WGF1000TCE
R83-R85 = 0Ω: BOM_Manufacturer Part: 0R(000) ±1%; Value: 0Ω; BOM_Supplier Part: undefined; BOM_Supplier: LCSC; spicePre: R; spiceSymbolName: 0Ω

## Sheet NAND.schdoc
size 401 x 103 mm
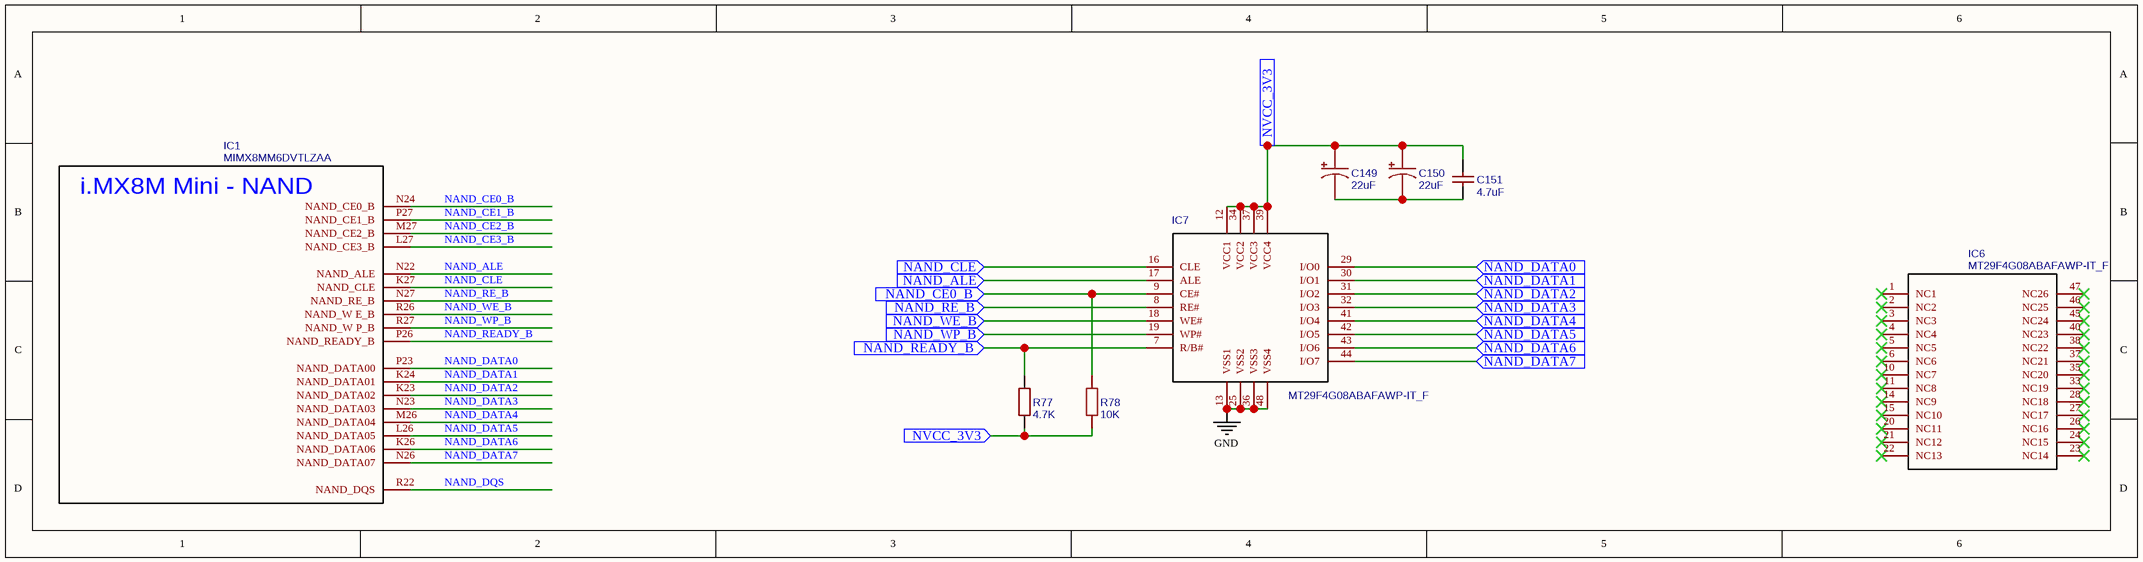
[diagram p6: NAND.schdoc]

### Parts
(Parts that share a designator on the sheet are numbered #1, #2 ... from top to bottom, then left to right.)
C149  22uF  [CAP-SMD_L3.2-W1.6-R-RD]
C150  22uF  [CAP-SMD_L3.2-W1.6-R-RD]
C151  4.7uF  [C0603]
IC1#4  MIMX8MM6DVTLZAA  [BGA486C50P27X27_1400X1400X125]
IC6  MT29F4G08ABAFAWP-IT_F  [SOP50P2000X120-48N]
IC7  MT29F4G08ABAFAWP-IT_F  [SOP50P2000X120-48N]
R77  4.7K  [R0402]
R78  10K  [R0402]

### Ports
NAND_ALE (in), NAND_CE0_B (in), NAND_CLE (in), NAND_DATA0 (in), NAND_DATA1 (in), NAND_DATA2 (in), NAND_DATA3 (in), NAND_DATA4 (in), NAND_DATA5 (in), NAND_DATA6 (in), NAND_DATA7 (in), NAND_RE_B (in), NAND_READY_B (in), NAND_WE_B (in), NAND_WP_B (in), NVCC_3V3 (in)

### Nets
GND: IC7.13(VSS1) IC7.25(VSS2) IC7.36(VSS3) IC7.48(VSS4)
NAND_ALE: IC1#4.N22(NAND_ALE)
NAND_CE0_B: IC1#4.N24(NAND_CE0_B)
NAND_CE1_B: IC1#4.P27(NAND_CE1_B)
NAND_CE2_B: IC1#4.M27(NAND_CE2_B)
NAND_CE3_B: IC1#4.L27(NAND_CE3_B)
NAND_CLE: IC1#4.K27(NAND_CLE)
NAND_DATA0: IC1#4.P23(NAND_DATA00)
NAND_DATA1: IC1#4.K24(NAND_DATA01)
NAND_DATA2: IC1#4.K23(NAND_DATA02)
NAND_DATA3: IC1#4.N23(NAND_DATA03)
NAND_DATA4: IC1#4.M26(NAND_DATA04)
NAND_DATA5: IC1#4.L26(NAND_DATA05)
NAND_DATA6: IC1#4.K26(NAND_DATA06)
NAND_DATA7: IC1#4.N26(NAND_DATA07)
NAND_DQS: IC1#4.R22(NAND_DQS)
NAND_RE_B: IC1#4.N27(NAND_RE_B)
NAND_READY_B: IC1#4.P26(NAND_READY_B)
NAND_WE_B: IC1#4.R26(NAND_W_E_B)
NAND_WP_B: IC1#4.R27(NAND_W_P_B)
NetC37_2: C149.1 C150.1 C151.2 IC7.12(VCC1) IC7.34(VCC2) IC7.37(VCC3) IC7.39(VCC4) R77.1 R78.1 ; port NVCC_3V3
NetC149_2: C149.2 C150.2 C151.1
NetIC7_7: IC7.7(R/B#) R77.2 ; port NAND_READY_B
NetIC7_8: IC7.8(RE#) ; port NAND_RE_B
NetIC7_9: IC7.9(CE#) R78.2 ; port NAND_CE0_B
NetIC7_16: IC7.16(CLE) ; port NAND_CLE
NetIC7_17: IC7.17(ALE) ; port NAND_ALE
NetIC7_18: IC7.18(WE#) ; port NAND_WE_B
NetIC7_19: IC7.19(WP#) ; port NAND_WP_B
NetIC7_29: IC7.29(I/O0) ; port NAND_DATA0
NetIC7_30: IC7.30(I/O1) ; port NAND_DATA1
NetIC7_31: IC7.31(I/O2) ; port NAND_DATA2
NetIC7_32: IC7.32(I/O3) ; port NAND_DATA3
NetIC7_41: IC7.41(I/O4) ; port NAND_DATA4
NetIC7_42: IC7.42(I/O5) ; port NAND_DATA5
NetIC7_43: IC7.43(I/O6) ; port NAND_DATA6
NetIC7_44: IC7.44(I/O7) ; port NAND_DATA7

Not connected (* = marked no-connect by the designer): IC6 1(NC1)* 2(NC2)* 3(NC3)* 4(NC4)* 5(NC5)* 6(NC6)* 10(NC7)* 11(NC8)* 14(NC9)* 15(NC10)* 20(NC11)* 21(NC12)* 22(NC13)* 23(NC14)* 24(NC15)* 26(NC16)* 27(NC17)* 28(NC18)* 33(NC19)* 35(NC20)* 37(NC21)* 38(NC22)* 40(NC23)* 45(NC24)* 46(NC25)* 47(NC26)*

### Notes on the sheet
- (in symbol MIMX8MM6DVTLZAA) i.MX8M Mini - NAND

### Library data of the parts
C149 C150 = 22uF: BOM_Manufacturer: Shenzhen Zhenhua XinYun Elec; BOM_Manufacturer Part: CA45B-A-10V-22uF-K; nameAlias: Capacitance; Contributor: LCSC; SMT Type: Extend; BOM_Supplier: LCSC; BOM_Supplier Part: C141305; BOM_JLCPCB SMD: Yes; spicePre: C; spiceSymbolName: CA45B-A-10V-22UF-K
C151 = 4.7uF: BOM_Manufacturer Part: CL10A475KP8NNNC; BOM_Manufacturer: SAMSUNG; nameAlias: Capacitance; SMT Type: Extend; BOM_Supplier: LCSC; BOM_Supplier Part: C1705; BOM_JLCPCB SMD: Yes; spicePre: C; spiceSymbolName: CL10A475KP8NNNC
IC1#4 = MIMX8MM6DVTLZAA: as IC1#1 on sheet CAMERA; spicePre: I; spiceSymbolName: MIMX8MM6DVTLZAA
IC6 = MT29F4G08ABAFAWP-IT_F: subpart_no: 2; Contributor: Ke'Ondrae_Mell; spicePre: I; spiceSymbolName: MT29F4G08ABAFAWP-IT_F
IC7 = MT29F4G08ABAFAWP-IT_F: subpart_no: 1; Contributor: Ke'Ondrae_Mell; spicePre: I; spiceSymbolName: MT29F4G08ABAFAWP-IT_F
R77 = 4.7K: as R76 on sheet CAMERA; BOM_Supplier: LCSC; BOM_Supplier Part: C25900; BOM_JLCPCB SMD: Yes; spicePre: R; spiceSymbolName: 0402WGF4701TCE
R78 = 10K: BOM_Manufacturer: Uniroyal Elec; BOM_Manufacturer Part: NQ02WGF1002TCE; nameAlias: Resistance (Ohms); Contributor: LCSC; SMT Type: Extend; BOM_Supplier: LCSC; BOM_Supplier Part: C270381; BOM_JLCPCB SMD: Yes; spicePre: R; spiceSymbolName: NQ02WGF1002TCE

## Sheet NOT CONNECTED.schdoc
size 502 x 311 mm
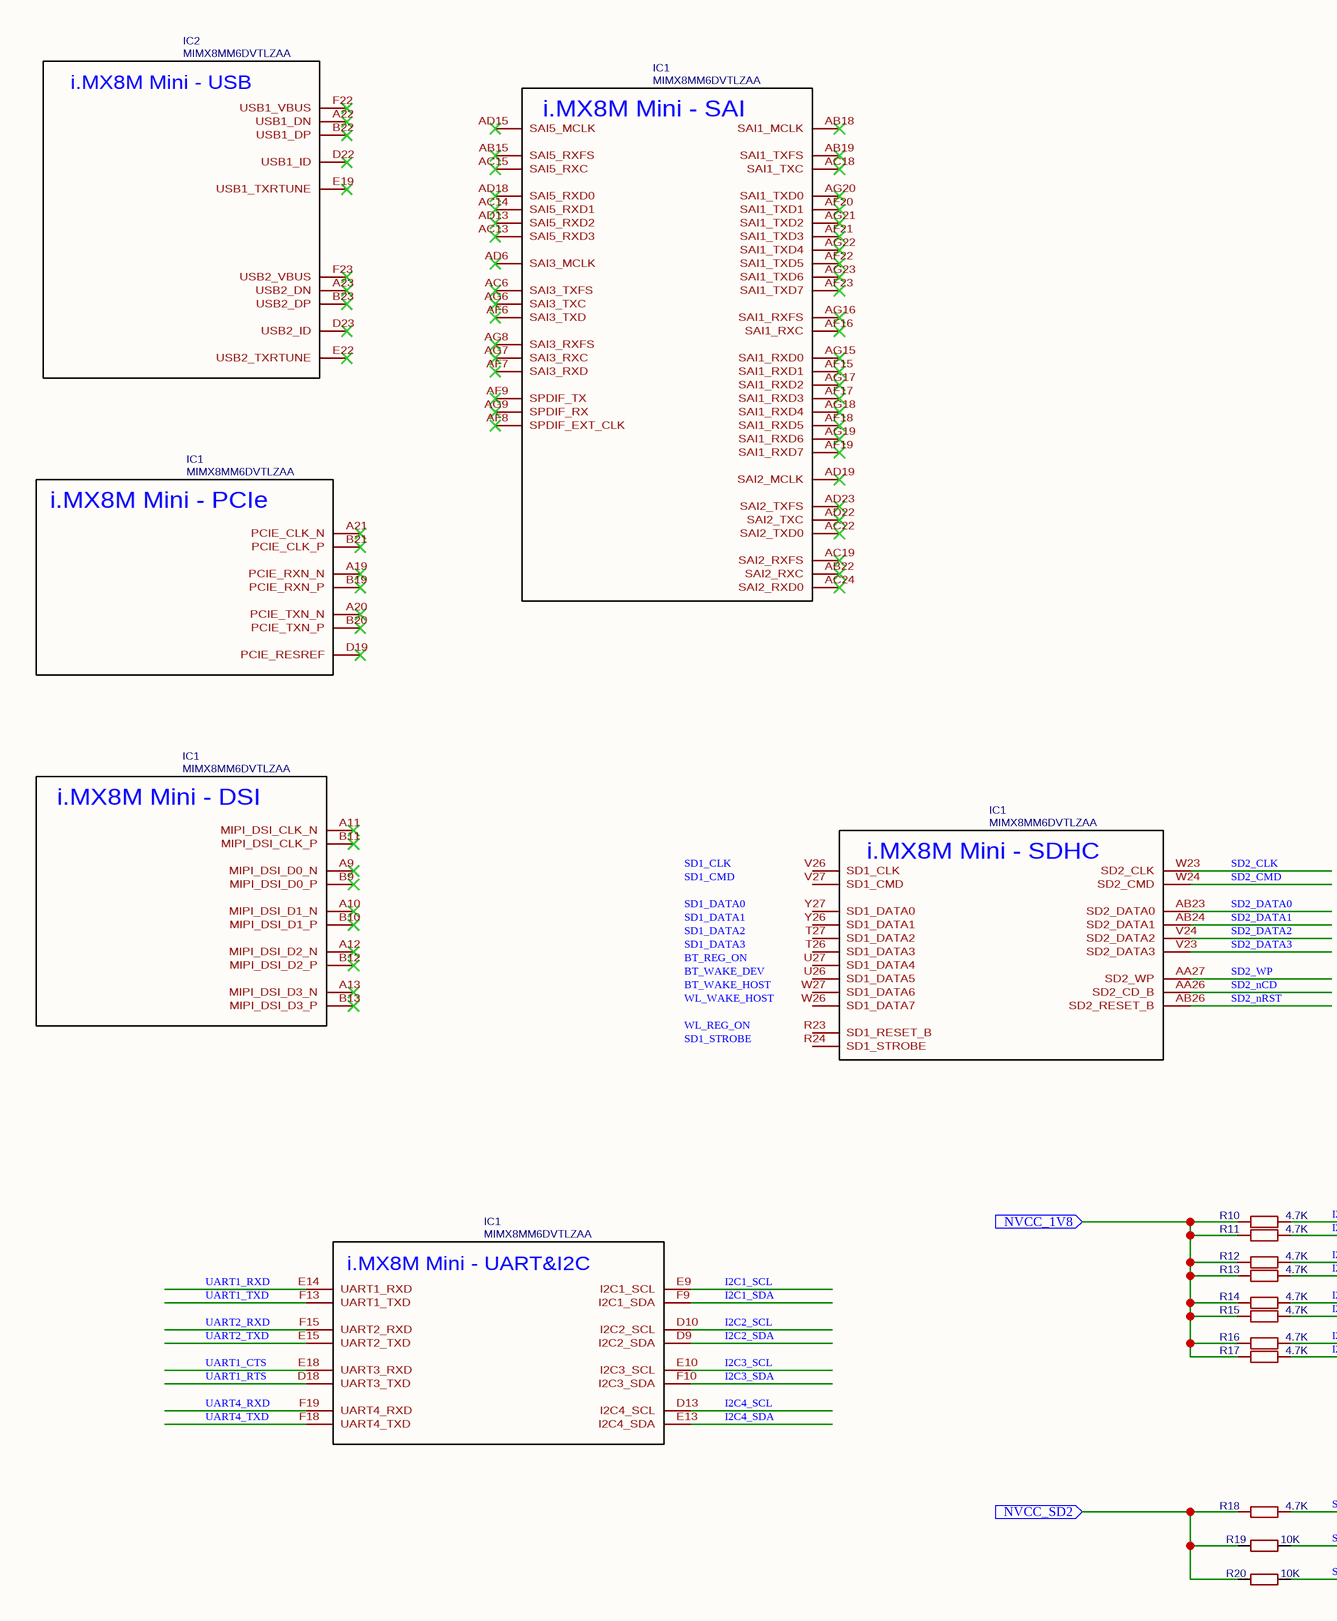
[diagram p7: NOT CONNECTED.schdoc, left]
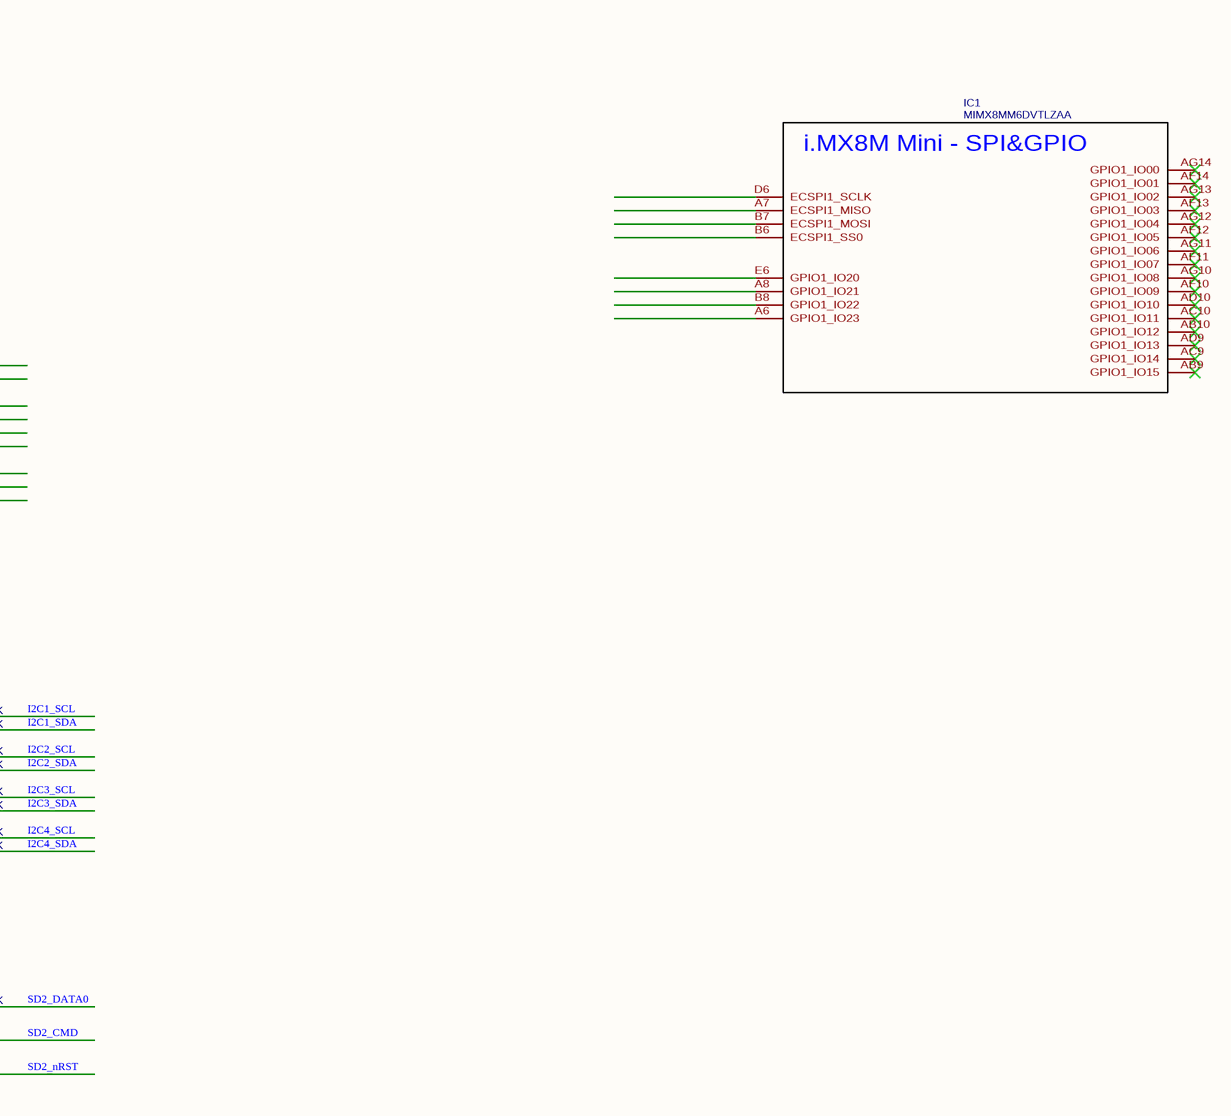
[diagram p8: NOT CONNECTED.schdoc, right]

### Parts
(Parts that share a designator on the sheet are numbered #1, #2 ... from top to bottom, then left to right.)
IC1#5  MIMX8MM6DVTLZAA  [BGA486C50P27X27_1400X1400X125]
IC1#6  MIMX8MM6DVTLZAA  [BGA486C50P27X27_1400X1400X125]
IC1#7  MIMX8MM6DVTLZAA  [BGA486C50P27X27_1400X1400X125]
IC1#8  MIMX8MM6DVTLZAA  [BGA486C50P27X27_1400X1400X125]
IC1#9  MIMX8MM6DVTLZAA  [BGA486C50P27X27_1400X1400X125]
IC1#10  MIMX8MM6DVTLZAA  [BGA486C50P27X27_1400X1400X125]
IC2  MIMX8MM6DVTLZAA  [BGA486C50P27X27_1400X1400X125]
R10  4.7K  [R0402]
R11  4.7K  [R0402]
R12  4.7K  [R0402]
R13  4.7K  [R0402]
R14  4.7K  [R0402]
R15  4.7K  [R0402]
R16  4.7K  [R0402]
R17  4.7K  [R0402]
R18  4.7K  [R0402]
R19  10K  [R0402]
R20  10K  [R0402]

### Ports
NVCC_1V8 (in), NVCC_SD2 (in)

### Nets
I2C1_SCL: IC1#10.E9(I2C1_SCL) R10.2
I2C1_SDA: IC1#10.F9(I2C1_SDA) R11.2
I2C2_SCL: IC1#10.D10(I2C2_SCL) R12.2
I2C2_SDA: IC1#10.D9(I2C2_SDA) R13.2
I2C3_SCL: IC1#10.E10(I2C3_SCL) R14.2
I2C3_SDA: IC1#10.F10(I2C3_SDA) R15.2
I2C4_SCL: IC1#10.D13(I2C4_SCL) R16.2
I2C4_SDA: IC1#10.E13(I2C4_SDA) R17.2
SD2_CLK: IC1#9.W23(SD2_CLK)
SD2_CMD: IC1#9.W24(SD2_CMD) R19.2
SD2_DATA0: IC1#9.AB23(SD2_DATA0) R18.2
SD2_DATA1: IC1#9.AB24(SD2_DATA1)
SD2_DATA2: IC1#9.V24(SD2_DATA2)
SD2_DATA3: IC1#9.V23(SD2_DATA3)
SD2_nCD: IC1#9.AA26(SD2_CD_B)
SD2_nRST: IC1#9.AB26(SD2_RESET_B) R20.2
SD2_WP: IC1#9.AA27(SD2_WP)
UART1_CTS: IC1#10.E18(UART3_RXD)
UART1_RTS: IC1#10.D18(UART3_TXD)
UART1_RXD: IC1#10.E14(UART1_RXD)
UART1_TXD: IC1#10.F13(UART1_TXD)
UART2_RXD: IC1#10.F15(UART2_RXD)
UART2_TXD: IC1#10.E15(UART2_TXD)
UART4_RXD: IC1#10.F19(UART4_RXD)
UART4_TXD: IC1#10.F18(UART4_TXD)
NetC33_2: R10.1 R11.1 R12.1 R13.1 R14.1 R15.1 R16.1 R17.1 ; port NVCC_1V8
NetC43_2: R18.1 R19.1 R20.1 ; port NVCC_SD2

Not connected (* = marked no-connect by the designer): IC1#5 AB15(SAI5_RXFS)* AB18(SAI1_MCLK)* AB19(SAI1_TXFS)* AB22(SAI2_RXC)* AC6(SAI3_TXFS)* AC13(SAI5_RXD3)* AC14(SAI5_RXD1)* AC15(SAI5_RXC)* AC18(SAI1_TXC)* AC19(SAI2_RXFS)* AC22(SAI2_TXD0)* AC24(SAI2_RXD0)* AD6(SAI3_MCLK)* AD13(SAI5_RXD2)* AD15(SAI5_MCLK)* AD18(SAI5_RXD0)* AD19(SAI2_MCLK)* AD22(SAI2_TXC)* AD23(SAI2_TXFS)* AF6(SAI3_TXD)* AF7(SAI3_RXD)* AF8(SPDIF_EXT_CLK)* AF9(SPDIF_TX)* AF15(SAI1_RXD1)* AF16(SAI1_RXC)* AF17(SAI1_RXD3)* AF18(SAI1_RXD5)* AF19(SAI1_RXD7)* AF20(SAI1_TXD1)* AF21(SAI1_TXD3)* AF22(SAI1_TXD5)* AF23(SAI1_TXD7)* AG6(SAI3_TXC)* AG7(SAI3_RXC)* AG8(SAI3_RXFS)* AG9(SPDIF_RX)* AG15(SAI1_RXD0)* AG16(SAI1_RXFS)* AG17(SAI1_RXD2)* AG18(SAI1_RXD4)* AG19(SAI1_RXD6)* AG20(SAI1_TXD0)* AG21(SAI1_TXD2)* AG22(SAI1_TXD4)* AG23(SAI1_TXD6)*; IC1#6 A19(PCIE_RXN_N)* A20(PCIE_TXN_N)* A21(PCIE_CLK_N)* B19(PCIE_RXN_P)* B20(PCIE_TXN_P)* B21(PCIE_CLK_P)* D19(PCIE_RESREF)*; IC1#7 A6(GPIO1_IO23) A7(ECSPI1_MISO) A8(GPIO1_IO21) AB9(GPIO1_IO15)* AB10(GPIO1_IO12)* AC9(GPIO1_IO14)* AC10(GPIO1_IO11)* AD9(GPIO1_IO13)* AD10(GPIO1_IO10)* AF10(GPIO1_IO09)* AF11(GPIO1_IO07)* AF12(GPIO1_IO05)* AF13(GPIO1_IO03)* AF14(GPIO1_IO01)* AG10(GPIO1_IO08)* AG11(GPIO1_IO06)* AG12(GPIO1_IO04)* AG13(GPIO1_IO02)* AG14(GPIO1_IO00)* B6(ECSPI1_SS0) B7(ECSPI1_MOSI) B8(GPIO1_IO22) D6(ECSPI1_SCLK) E6(GPIO1_IO20); IC1#8 A9(MIPI_DSI_D0_N)* A10(MIPI_DSI_D1_N)* A11(MIPI_DSI_CLK_N)* A12(MIPI_DSI_D2_N)* A13(MIPI_DSI_D3_N)* B9(MIPI_DSI_D0_P)* B10(MIPI_DSI_D1_P)* B11(MIPI_DSI_CLK_P)* B12(MIPI_DSI_D2_P)* B13(MIPI_DSI_D3_P)*; IC1#9 R23(SD1_RESET_B) R24(SD1_STROBE) T26(SD1_DATA3) T27(SD1_DATA2) U26(SD1_DATA5) U27(SD1_DATA4) V26(SD1_CLK) V27(SD1_CMD) W26(SD1_DATA7) W27(SD1_DATA6) Y26(SD1_DATA1) Y27(SD1_DATA0); IC2 A22(USB1_DN)* A23(USB2_DN)* B22(USB1_DP)* B23(USB2_DP)* D22(USB1_ID)* D23(USB2_ID)* E19(USB1_TXRTUNE)* E22(USB2_TXRTUNE)* F22(USB1_VBUS)* F23(USB2_VBUS)*

### Notes on the sheet
- Labels drawn without touching a wire or pin: BT_REG_ON, BT_WAKE_DEV, BT_WAKE_HOST, SD1_CLK, SD1_CMD, SD1_DATA0, SD1_DATA1, SD1_DATA2, SD1_DATA3, SD1_STROBE, WL_REG_ON, WL_WAKE_HOST
- (in symbol MIMX8MM6DVTLZAA) i.MX8M Mini - USB; i.MX8M Mini - PCIe; i.MX8M Mini - DSI; i.MX8M Mini - UART&I2C; i.MX8M Mini - SAI; i.MX8M Mini - SPI&GPIO; i.MX8M Mini - SDHC

### Library data of the parts
IC1#5-IC1#10 IC2 = MIMX8MM6DVTLZAA: as IC1#1 on sheet CAMERA; spicePre: I; spiceSymbolName: MIMX8MM6DVTLZAA
R10-R18 = 4.7K: BOM_Manufacturer: Huaxin S&T; BOM_Manufacturer Part: MR04X4701FTL; nameAlias: Resistance (Ohms); Contributor: LCSC; BOM_Supplier: LCSC; BOM_Supplier Part: C327817; spicePre: R; spiceSymbolName: MR04X4701FTL
R19 R20 = 10K: as R29 on sheet CPU MISC; BOM_Supplier: LCSC; BOM_Supplier Part: C98838; BOM_JLCPCB SMD: Yes; spicePre: R; spiceSymbolName: TC0225F1002TCE

## Sheet PMIC.schdoc
size 487 x 325 mm
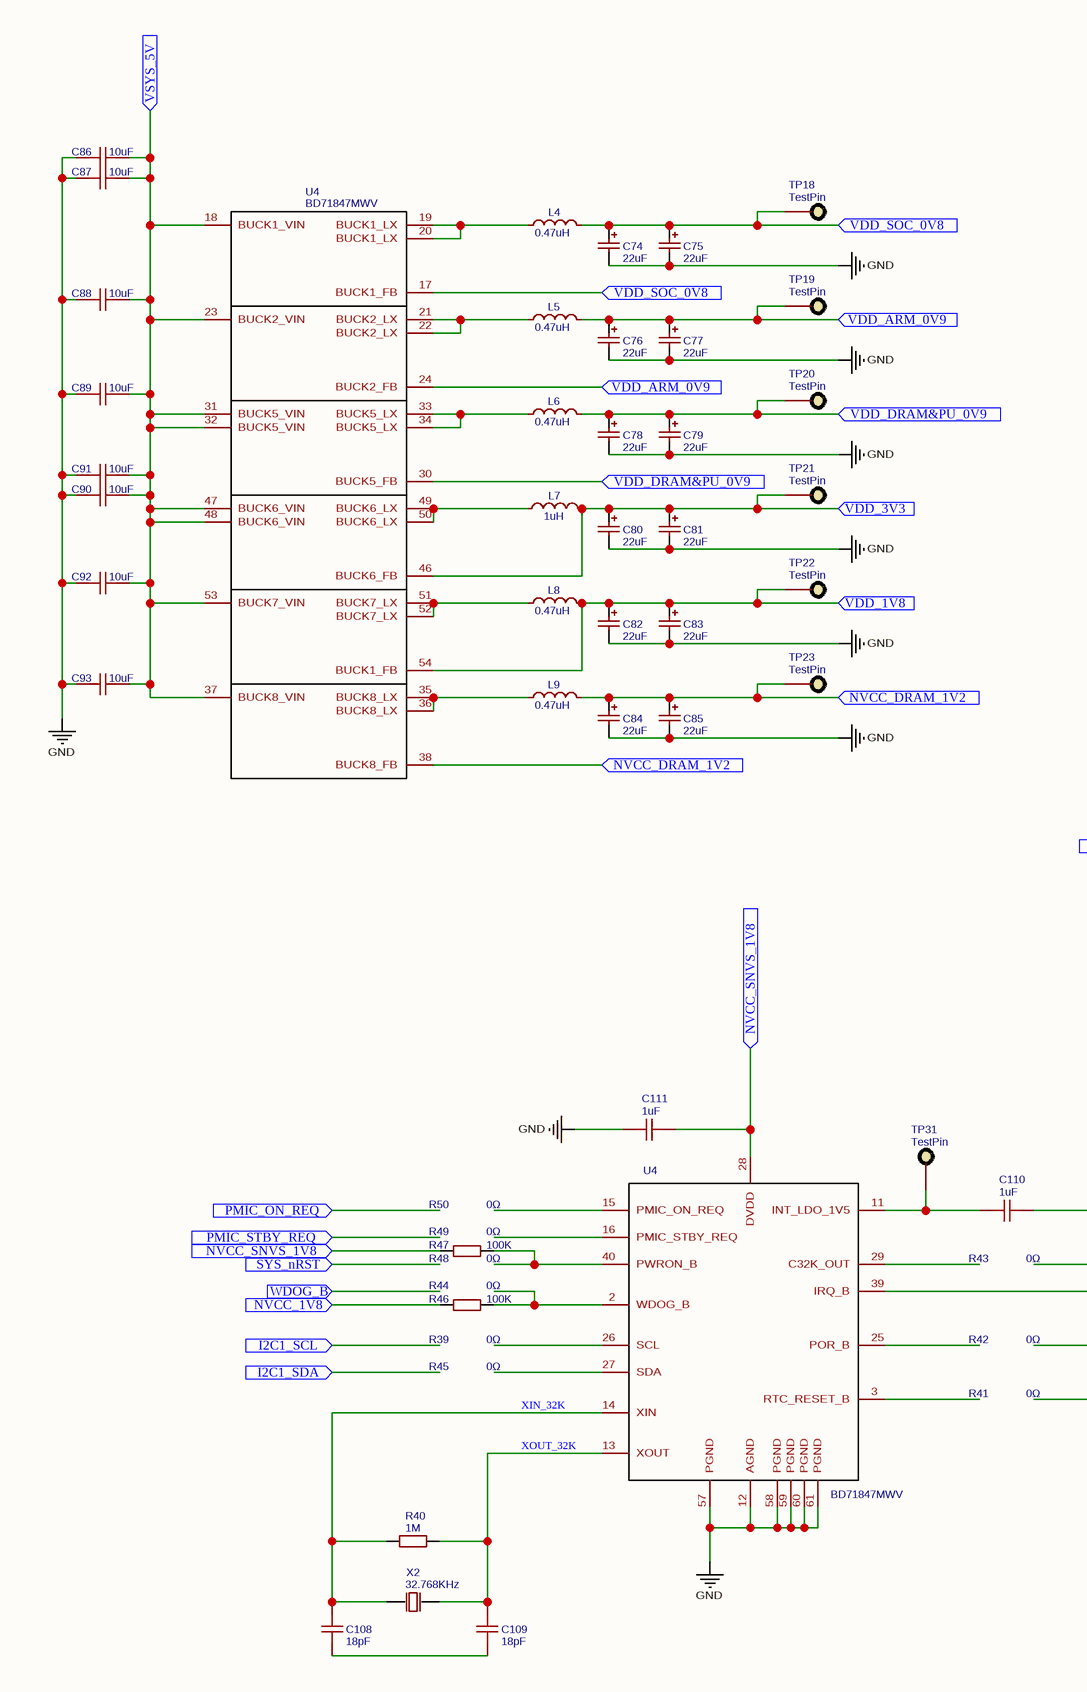
[diagram p9: PMIC.schdoc, left]
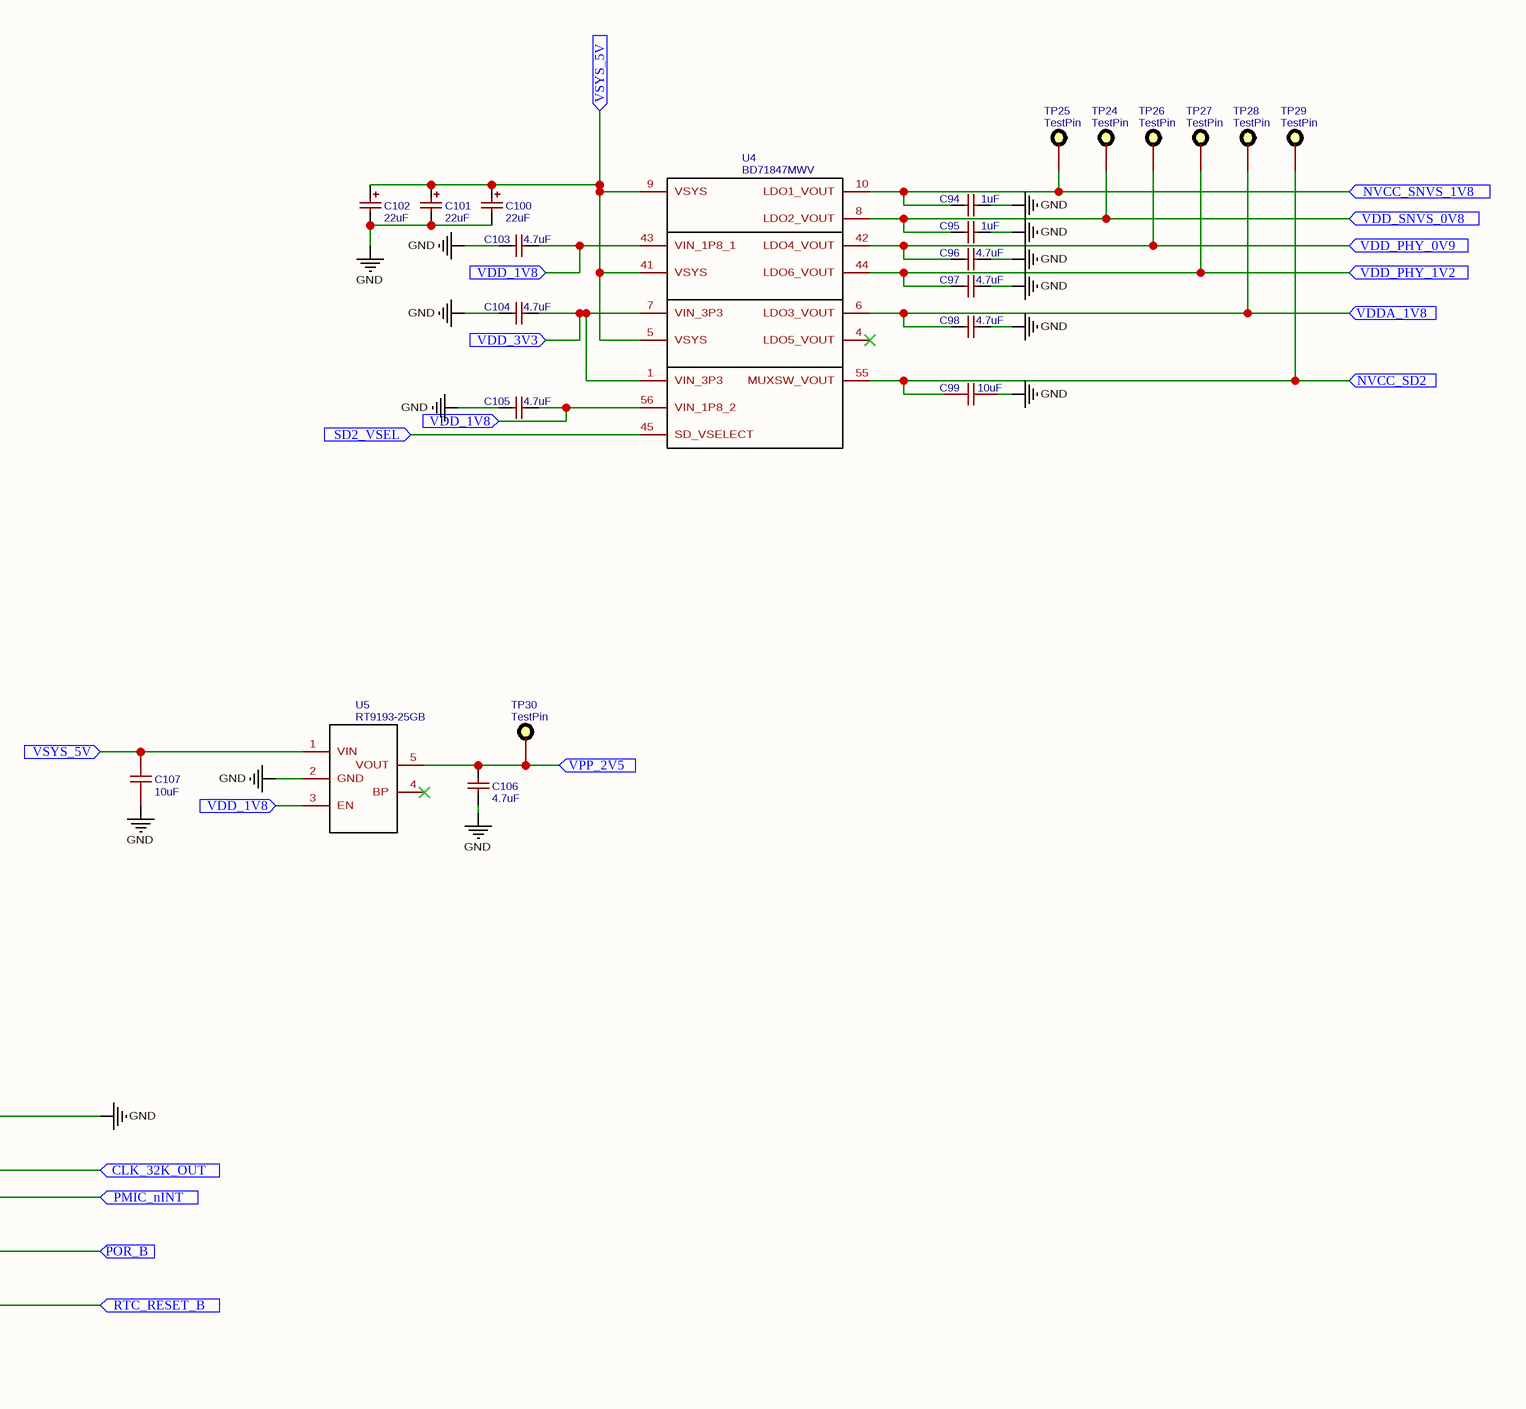
[diagram p10: PMIC.schdoc, right]

### Parts
(Parts that share a designator on the sheet are numbered #1, #2 ... from top to bottom, then left to right.)
C74  22uF  [CAP-SMD_L2.0-W1.2-R-RD]
C75  22uF  [CAP-SMD_L2.0-W1.2-R-RD]
C76  22uF  [CAP-SMD_L2.0-W1.2-R-RD]
C77  22uF  [CAP-SMD_L2.0-W1.2-R-RD]
C78  22uF  [CAP-SMD_L2.0-W1.2-R-RD]
C79  22uF  [CAP-SMD_L2.0-W1.2-R-RD]
C80  22uF  [CAP-SMD_L2.0-W1.2-R-RD]
C81  22uF  [CAP-SMD_L2.0-W1.2-R-RD]
C82  22uF  [CAP-SMD_L2.0-W1.2-R-RD]
C83  22uF  [CAP-SMD_L2.0-W1.2-R-RD]
C84  22uF  [CAP-SMD_L2.0-W1.2-R-RD]
C85  22uF  [CAP-SMD_L2.0-W1.2-R-RD]
C86  10uF  [C0805]
C87  10uF  [C0805]
C88  10uF  [C0805]
C89  10uF  [C0805]
C90  10uF  [C0805]
C91  10uF  [C0805]
C92  10uF  [C0805]
C93  10uF  [C0805]
C94  1uF  [C0402]
C95  1uF  [C0402]
C96  4.7uF  [C0402]
C97  4.7uF  [C0402]
C98  4.7uF  [C0402]
C99  10uF  [C0805]
C100  22uF  [CAP-SMD_L2.0-W1.2-R-RD]
C101  22uF  [CAP-SMD_L2.0-W1.2-R-RD]
C102  22uF  [CAP-SMD_L2.0-W1.2-R-RD]
C103  4.7uF  [C0402]
C104  4.7uF  [C0402]
C105  4.7uF  [C0402]
C106  4.7uF  [C0402]
C107  10uF  [C0805]
C108  18pF  [C0402]
C109  18pF  [C0402]
C110  1uF  [C0402]
C111  1uF  [C0402]
L4  0.47uH  [L0805]
L5  0.47uH  [L0805]
L6  0.47uH  [L0805]
L7  1uH  [L0402]
L8  0.47uH  [L0805]
L9  0.47uH  [L0805]
R39  0Ω  [1206]
R40  1M  [R0402]
R41  0Ω  [1206]
R42  0Ω  [1206]
R43  0Ω  [1206]
R44  0Ω  [1206]
R45  0Ω  [1206]
R46  100K  [R0402]
R47  100K  [R0402]
R48  0Ω  [1206]
R49  0Ω  [1206]
R50  0Ω  [1206]
TP18  TestPin  [TESTPIN]
TP19  TestPin  [TESTPIN]
TP20  TestPin  [TESTPIN]
TP21  TestPin  [TESTPIN]
TP22  TestPin  [TESTPIN]
TP23  TestPin  [TESTPIN]
TP24  TestPin  [TESTPIN]
TP25  TestPin  [TESTPIN]
TP26  TestPin  [TESTPIN]
TP27  TestPin  [TESTPIN]
TP28  TestPin  [TESTPIN]
TP29  TestPin  [TESTPIN]
TP30  TestPin  [TESTPIN]
TP31  TestPin  [TESTPIN]
U4#1  BD71847MWV  [QFN56_W7.0_L7.0_0.4P_EPAD]
U4#2  BD71847MWV  [QFN56_W7.0_L7.0_0.4P_EPAD]
U4#3  BD71847MWV  [QFN56_W7.0_L7.0_0.4P_EPAD]
U5  RT9193-25GB  [SOT-23-5]
X2  32.768KHz  [OSC-SMD_L2.0-W1.2]

### Ports
CLK_32K_OUT (in), I2C1_SCL (in), I2C1_SDA (in), NVCC_1V8 (in), NVCC_DRAM_1V2 (in), NVCC_SD2 (in), NVCC_SNVS_1V8 (in), PMIC_nINT (in), PMIC_ON_REQ (in), PMIC_STBY_REQ (in), POR_B (in), RTC_RESET_B (in), SD2_VSEL (in), SYS_nRST (in), VDD_1V8 (in), VDD_3V3 (in), VDD_ARM_0V9 (in), VDD_DRAM&PU_0V9 (in), VDD_PHY_0V9 (in), VDD_PHY_1V2 (in), VDD_SNVS_0V8 (in), VDD_SOC_0V8 (in), VDDA_1V8 (in), VPP_2V5 (in), VSYS_5V (in), WDOG_B (in)

### Nets
GND: C74.2 C75.2 C76.2 C77.2 C78.2 C79.2 C80.2 C81.2 C82.2 C83.2 C84.2 C85.2 C86.1 C87.1 C88.1 C89.1 C90.1 C91.1 C92.1 C93.1 C94.2 C95.2 C96.2 C97.2 C98.2 C99.2 C100.2 C101.2 C102.2 C103.1 C104.1 C105.1 C106.1 C107.1 C110.2 C111.1 U4#3.12(AGND) U4#3.57(PGND) U4#3.58(PGND) U4#3.59(PGND) U4#3.60(PGND) U4#3.61(PGND) U5.2(GND)
VDD_MIPI_1V2: C97.1 TP27.1 U4#1.44(LDO6_VOUT) ; port VDD_PHY_1V2
XIN_32K: C108.2 R40.1 U4#3.14(XIN) X2.1(OSC1)
XOUT_32K: C109.2 R40.2 U4#3.13(XOUT) X2.2(OSC2)
NetC1_2: C94.1 C111.2 R47.1 TP25.1 U4#1.10(LDO1_VOUT) U4#3.28(DVDD) ; port NVCC_SNVS_1V8
NetC2_2: C95.1 TP24.1 U4#1.8(LDO2_VOUT) ; port VDD_SNVS_0V8
NetC3_2: C98.1 TP28.1 U4#1.6(LDO3_VOUT) ; port VDDA_1V8
NetC4_2: C76.1 C77.1 L5.2 TP19.1 U4#2.24(BUCK2_FB) ; port VDD_ARM_0V9
NetC10_2: C74.1 C75.1 L4.2 TP18.1 U4#2.17(BUCK1_FB) ; port VDD_SOC_0V8
NetC16_2: C78.1 C79.1 L6.2 TP20.1 U4#2.30(BUCK5_FB) ; port VDD_DRAM&PU_0V9
NetC24_2: C84.1 C85.1 L9.2 TP23.1 U4#2.38(BUCK8_FB) ; port NVCC_DRAM_1V2
NetC33_2: C82.1 C83.1 C103.2 C105.2 L8.2 R46.1 TP22.1 U4#1.43(VIN_1P8_1) U4#1.56(VIN_1P8_2) U4#2.54(BUCK1_FB) U5.3(EN) ; port VDD_1V8, port NVCC_1V8
NetC37_2: C80.1 C81.1 C104.2 L7.2 TP21.1 U4#1.1(VIN_3P3) U4#1.7(VIN_3P3) U4#2.46(BUCK6_FB) ; port VDD_3V3
NetC43_2: C99.1 TP29.1 U4#1.55(MUXSW_VOUT) ; port NVCC_SD2
NetC54_2: C96.1 TP26.1 U4#1.42(LDO4_VOUT) ; port VDD_PHY_0V9
NetC60_2: C106.2 TP30.1 U5.5(VOUT) ; port VPP_2V5
NetC86_2: C86.2 C87.2 C88.2 C89.2 C90.2 C91.2 C92.2 C93.2 C100.1 C101.1 C102.1 C107.2 U4#1.5(VSYS) U4#1.9(VSYS) U4#1.41(VSYS) U4#2.18(BUCK1_VIN) U4#2.23(BUCK2_VIN) U4#2.31(BUCK5_VIN) U4#2.32(BUCK5_VIN) U4#2.37(BUCK8_VIN) U4#2.47(BUCK6_VIN) U4#2.48(BUCK6_VIN) U4#2.53(BUCK7_VIN) U5.1(VIN) ; port VSYS_5V
NetC108_1: C108.1 C109.1
NetC110_1: C110.1 TP31.1 U4#3.11(INT_LDO_1V5)
NetL4_1: L4.1 U4#2.19(BUCK1_LX) U4#2.20(BUCK1_LX)
NetL5_1: L5.1 U4#2.21(BUCK2_LX) U4#2.22(BUCK2_LX)
NetL6_1: L6.1 U4#2.33(BUCK5_LX) U4#2.34(BUCK5_LX)
NetL7_1: L7.1 U4#2.49(BUCK6_LX) U4#2.50(BUCK6_LX)
NetL8_1: L8.1 U4#2.51(BUCK7_LX) U4#2.52(BUCK7_LX)
NetL9_1: L9.1 U4#2.35(BUCK8_LX) U4#2.36(BUCK8_LX)
NetR46_2: R46.2 U4#3.2(WDOG_B)
NetR47_2: R47.2 U4#3.40(PWRON_B)
NetU4#1_45: U4#1.45(SD_VSELECT) ; port SD2_VSEL
NetU4#3_39: U4#3.39(IRQ_B) ; port PMIC_nINT

Not connected (* = marked no-connect by the designer): U4#1 4(LDO5_VOUT)*; U4#3 3(RTC_RESET_B) 15(PMIC_ON_REQ) 16(PMIC_STBY_REQ) 25(POR_B) 26(SCL) 27(SDA) 29(C32K_OUT); U5 4(BP)*

### Library data of the parts
C74-C85 C100-C102 = 22uF: BOM_Manufacturer: AVX; BOM_Manufacturer Part: TAJP226M006RNJ; nameAlias: Capacitance; SMT Type: Extend; BOM_Supplier: LCSC; BOM_Supplier Part: C11383; BOM_JLCPCB SMD: Yes; spicePre: C; spiceSymbolName: TAJP226M006RNJ
C86-C93 C99 C107 = 10uF: BOM_Manufacturer: FH; BOM_Manufacturer Part: 0805F106M160NT; nameAlias: Capacitance; SMT Type: Extend; BOM_Supplier: LCSC; BOM_Supplier Part: C90545; BOM_JLCPCB SMD: Yes; spicePre: C; spiceSymbolName: 0805F106M160NT
C94 C95 = 1uF: as C64 on sheet DDR4; BOM_Supplier: LCSC; BOM_Supplier Part: C14445; BOM_JLCPCB SMD: Yes; spicePre: C; spiceSymbolName: CL05A105KP5NNNC
C96-C98 C103-C106 = 4.7uF: as C56 on sheet DDR4; BOM_Supplier: LCSC; BOM_Supplier Part: C23733; BOM_JLCPCB SMD: Yes; spicePre: C; spiceSymbolName: CL05A475MP5NRNC
C108 C109 = 18pF: BOM_Manufacturer: MuRata; BOM_Manufacturer Part: GRM1555C1H180GA01D; nameAlias: Capacitance; BOM_Supplier: LCSC; BOM_Supplier Part: C81217; spicePre: C; spiceSymbolName: GRM1555C1H180GA01D
C110 C111 = 1uF: BOM_Manufacturer: SAMSUNG; BOM_Manufacturer Part: CL05A105KA5NQNC; nameAlias: Capacitance; SMT Type: Basic; BOM_Supplier: LCSC; BOM_Supplier Part: C52923; BOM_JLCPCB SMD: Yes; spicePre: C; spiceSymbolName: CL05A105KA5NQNC
L4-L6 L8 L9 = 0.47uH: BOM_Manufacturer: Murata Electronics; BOM_Manufacturer Part: LQW21HNR47J00L; nameAlias: Inductance; Contributor: LCSC; BOM_Supplier: LCSC; BOM_Supplier Part: C471382; spicePre: L; spiceSymbolName: LQW21HNR47J00L
L7 = 1uH: BOM_Manufacturer Part: SDFL1005Q1R0KTF; BOM_Manufacturer: Sunlord; nameAlias: Inductance; SMT Type: Extend; BOM_Supplier: LCSC; BOM_Supplier Part: C84468; BOM_JLCPCB SMD: Yes; spicePre: L; spiceSymbolName: SDFL1005Q1R0KTF
R39 R41-R45 R48-R50 = 0Ω: BOM_Manufacturer Part: 0R(000) ±1%; Value: 0Ω; BOM_Supplier Part: undefined; BOM_Supplier: LCSC; spicePre: R; spiceSymbolName: 0Ω
R40 = 1M: BOM_Manufacturer: UniOhm; BOM_Manufacturer Part: 0402WGF1004TCE; nameAlias: Resistance (Ohms); SMT Type: Basic; BOM_Supplier: LCSC; BOM_Supplier Part: C26083; BOM_JLCPCB SMD: Yes; spicePre: R; spiceSymbolName: 0402WGF1004TCE
R46 R47 = 100K: as R21 on sheet CPU MISC; BOM_Supplier: LCSC; BOM_Supplier Part: C25741; BOM_JLCPCB SMD: Yes; spicePre: R; spiceSymbolName: 0402WGF1003TCE
TP18-TP31 = TestPin: as TP1 on sheet CPU MISC; timeStamp: 1460711565; spicePre: T; spiceSymbolName: TestPin
U4#1-U4#3 = BD71847MWV: BOM_Manufacturer Part: BD71847AMWV-E2; subpart_no: 1; Contributor: jem555; BOM_Supplier: RS-Online; BOM_Supplier Part: Rohm; spicePre: U; spiceSymbolName: BD71847MWV
U5 = RT9193-25GB: BOM_Manufacturer: RICHTEK; BOM_Supplier Part: undefined; BOM_Supplier: LCSC; BOM_Manufacturer Part: RT9193-25GB; spicePre: U; spiceSymbolName: RT9193-25GB
X2 = 32.768KHz: BOM_Manufacturer: KDS Daishinku; nameAlias: Frequency; Contributor: LCSC; SMT Type: Extend; BOM_Supplier: LCSC; BOM_Supplier Part: C93231; BOM_Manufacturer Part: -; BOM_JLCPCB SMD: Yes; spicePre: X; spiceSymbolName: DST210AC 32.768KHz